# EAGLE board FlatSat_Final (EAGLE 9.6.2), part 1 of 2
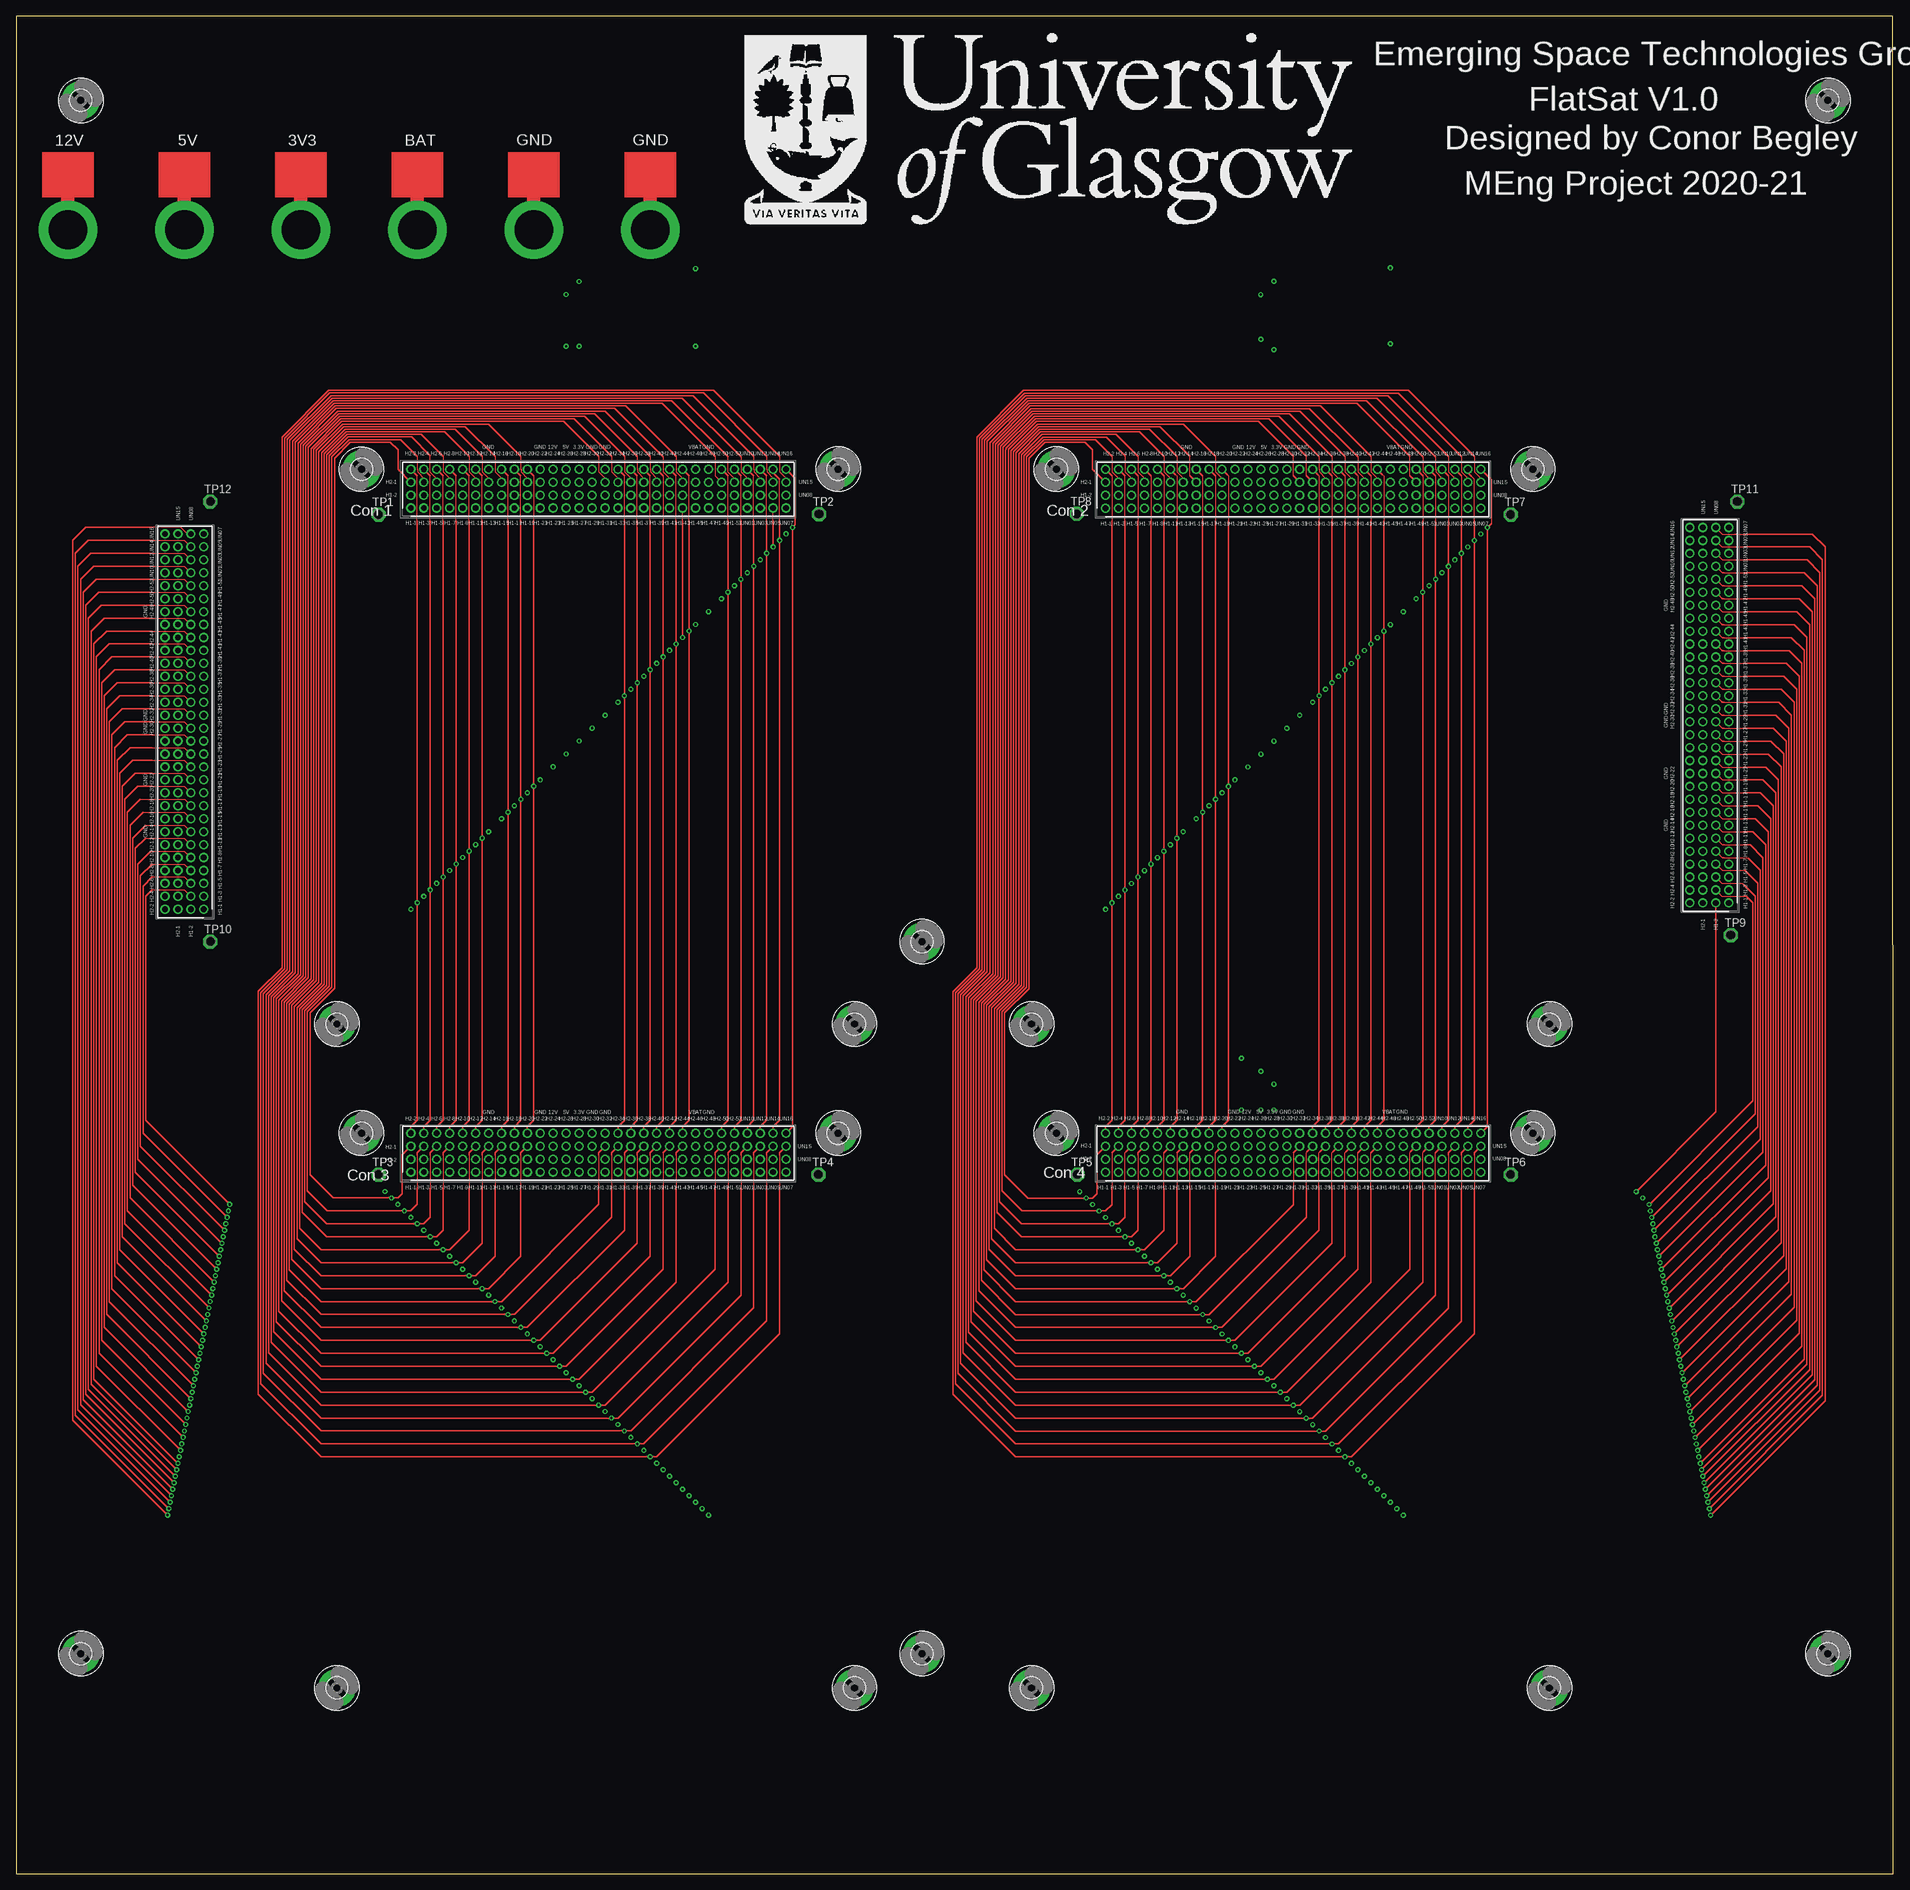
[diagram p6: board, top side]
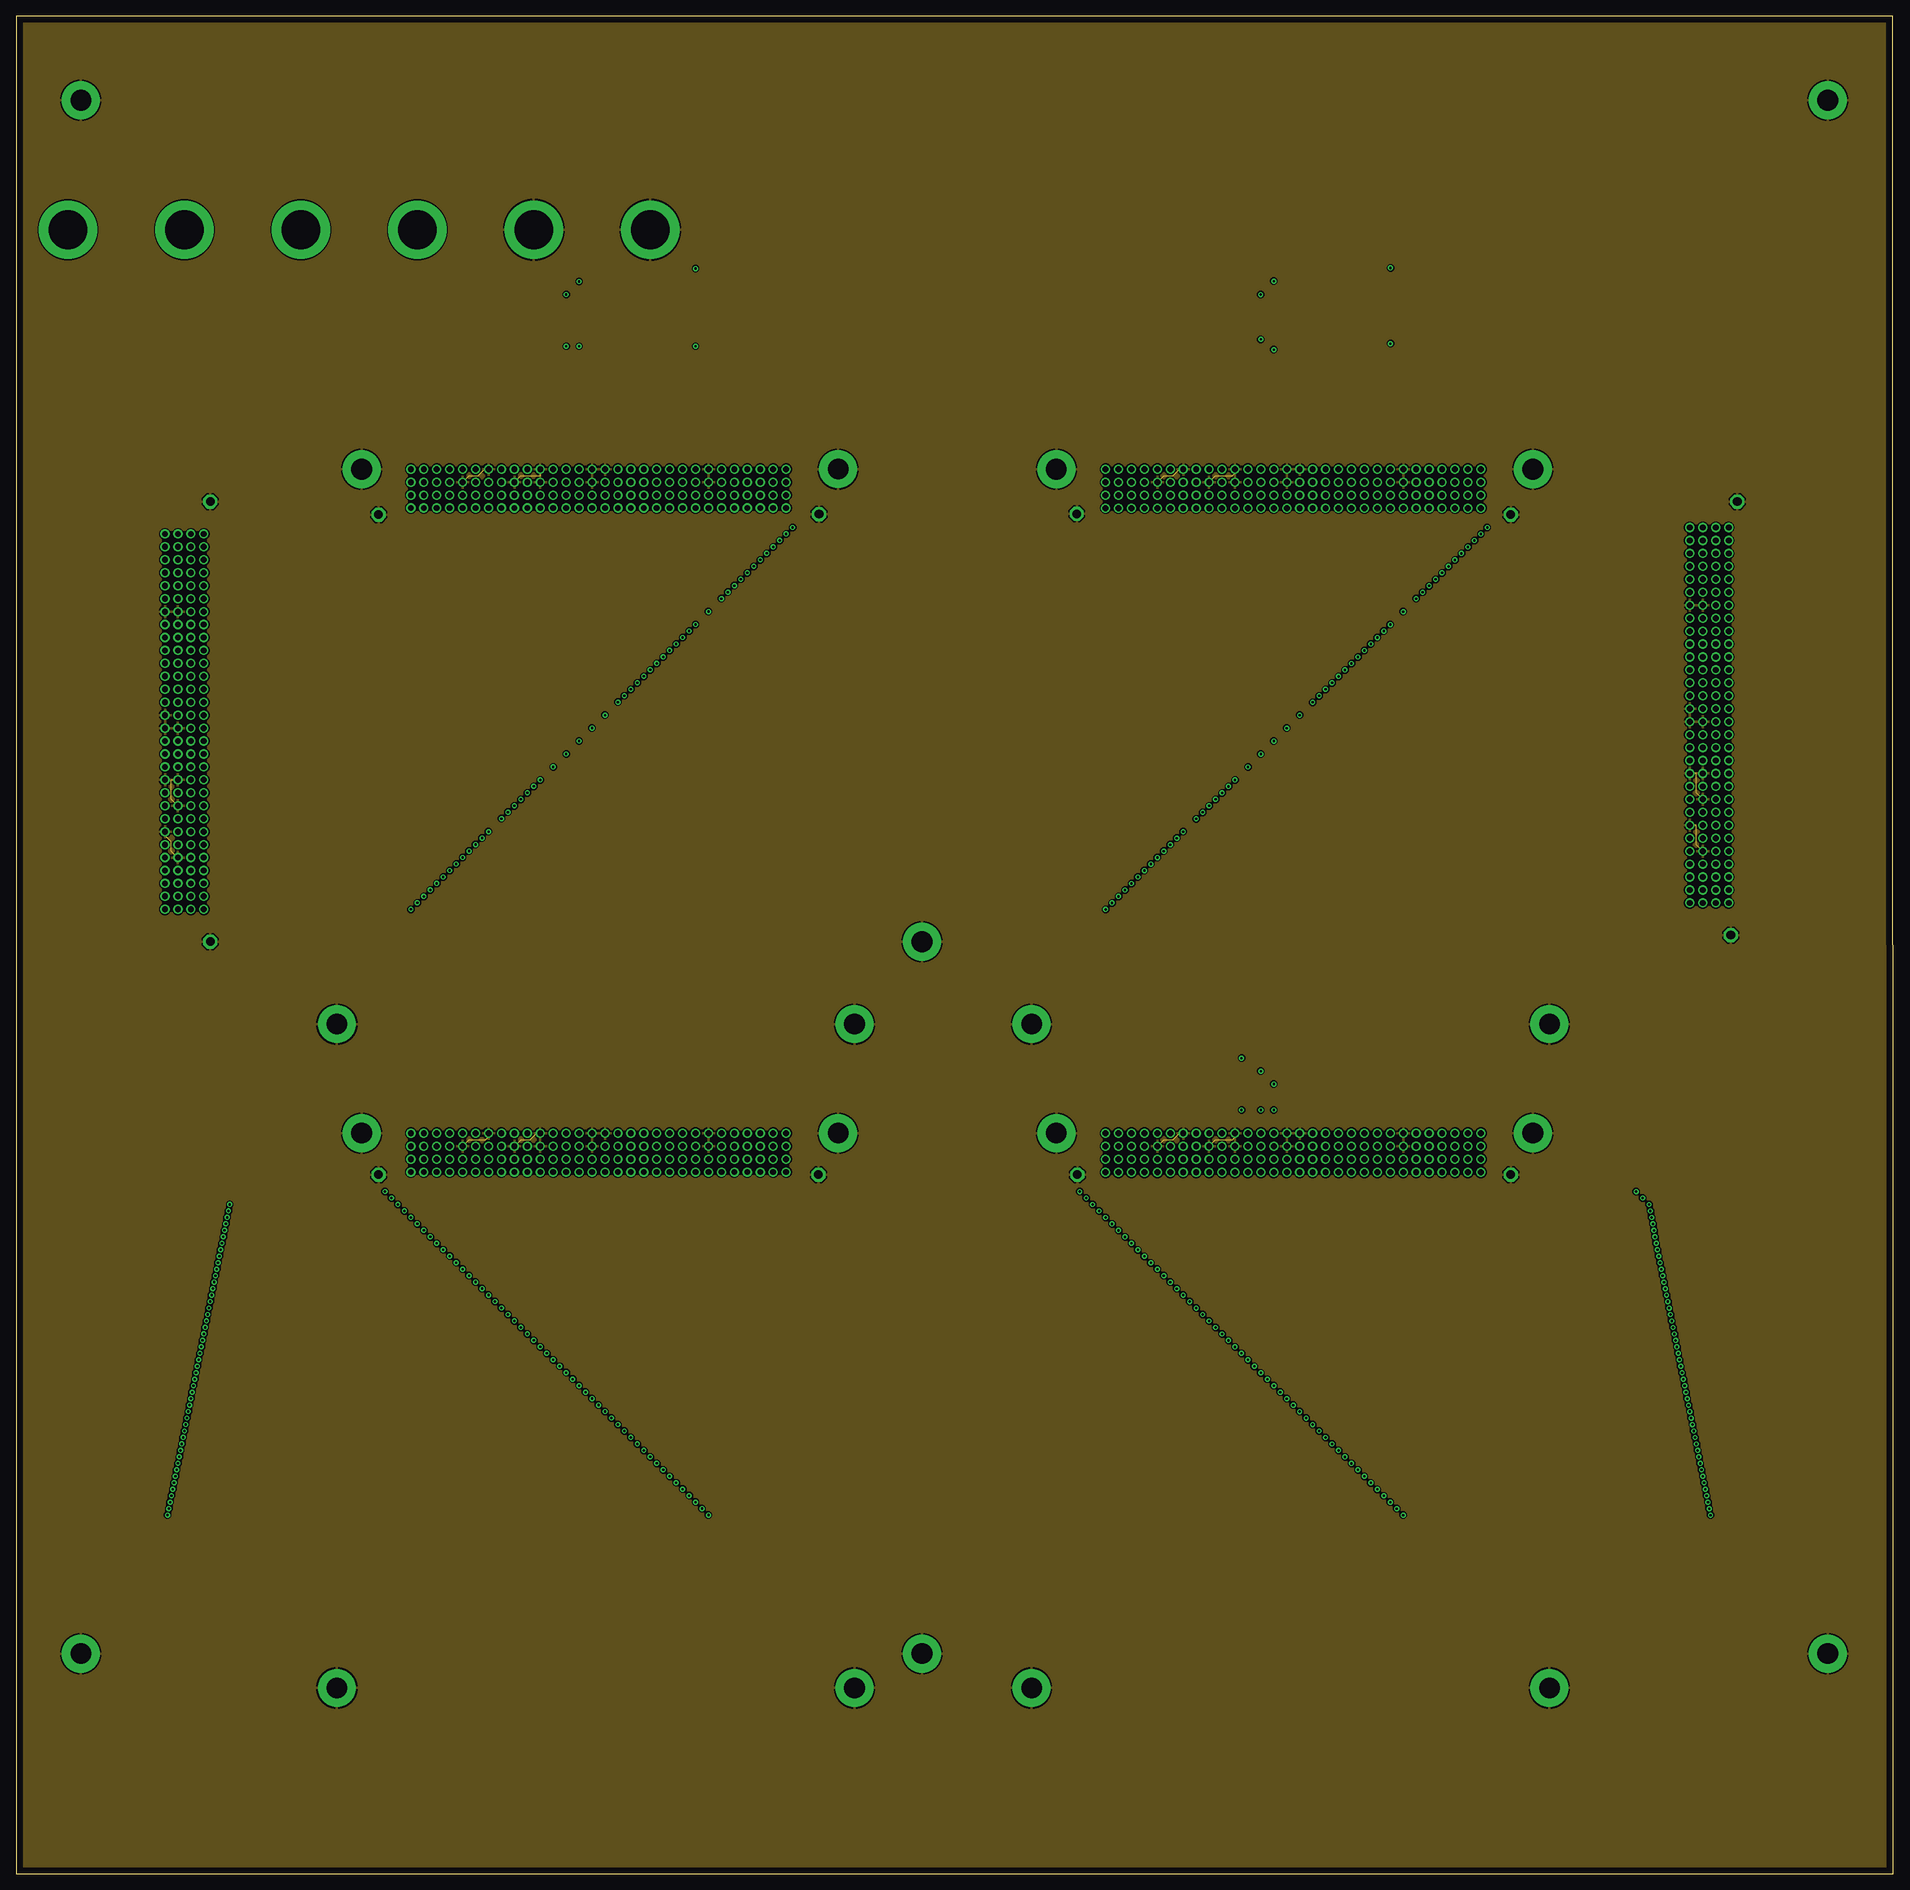
[diagram p7: board, inner layer Route2]
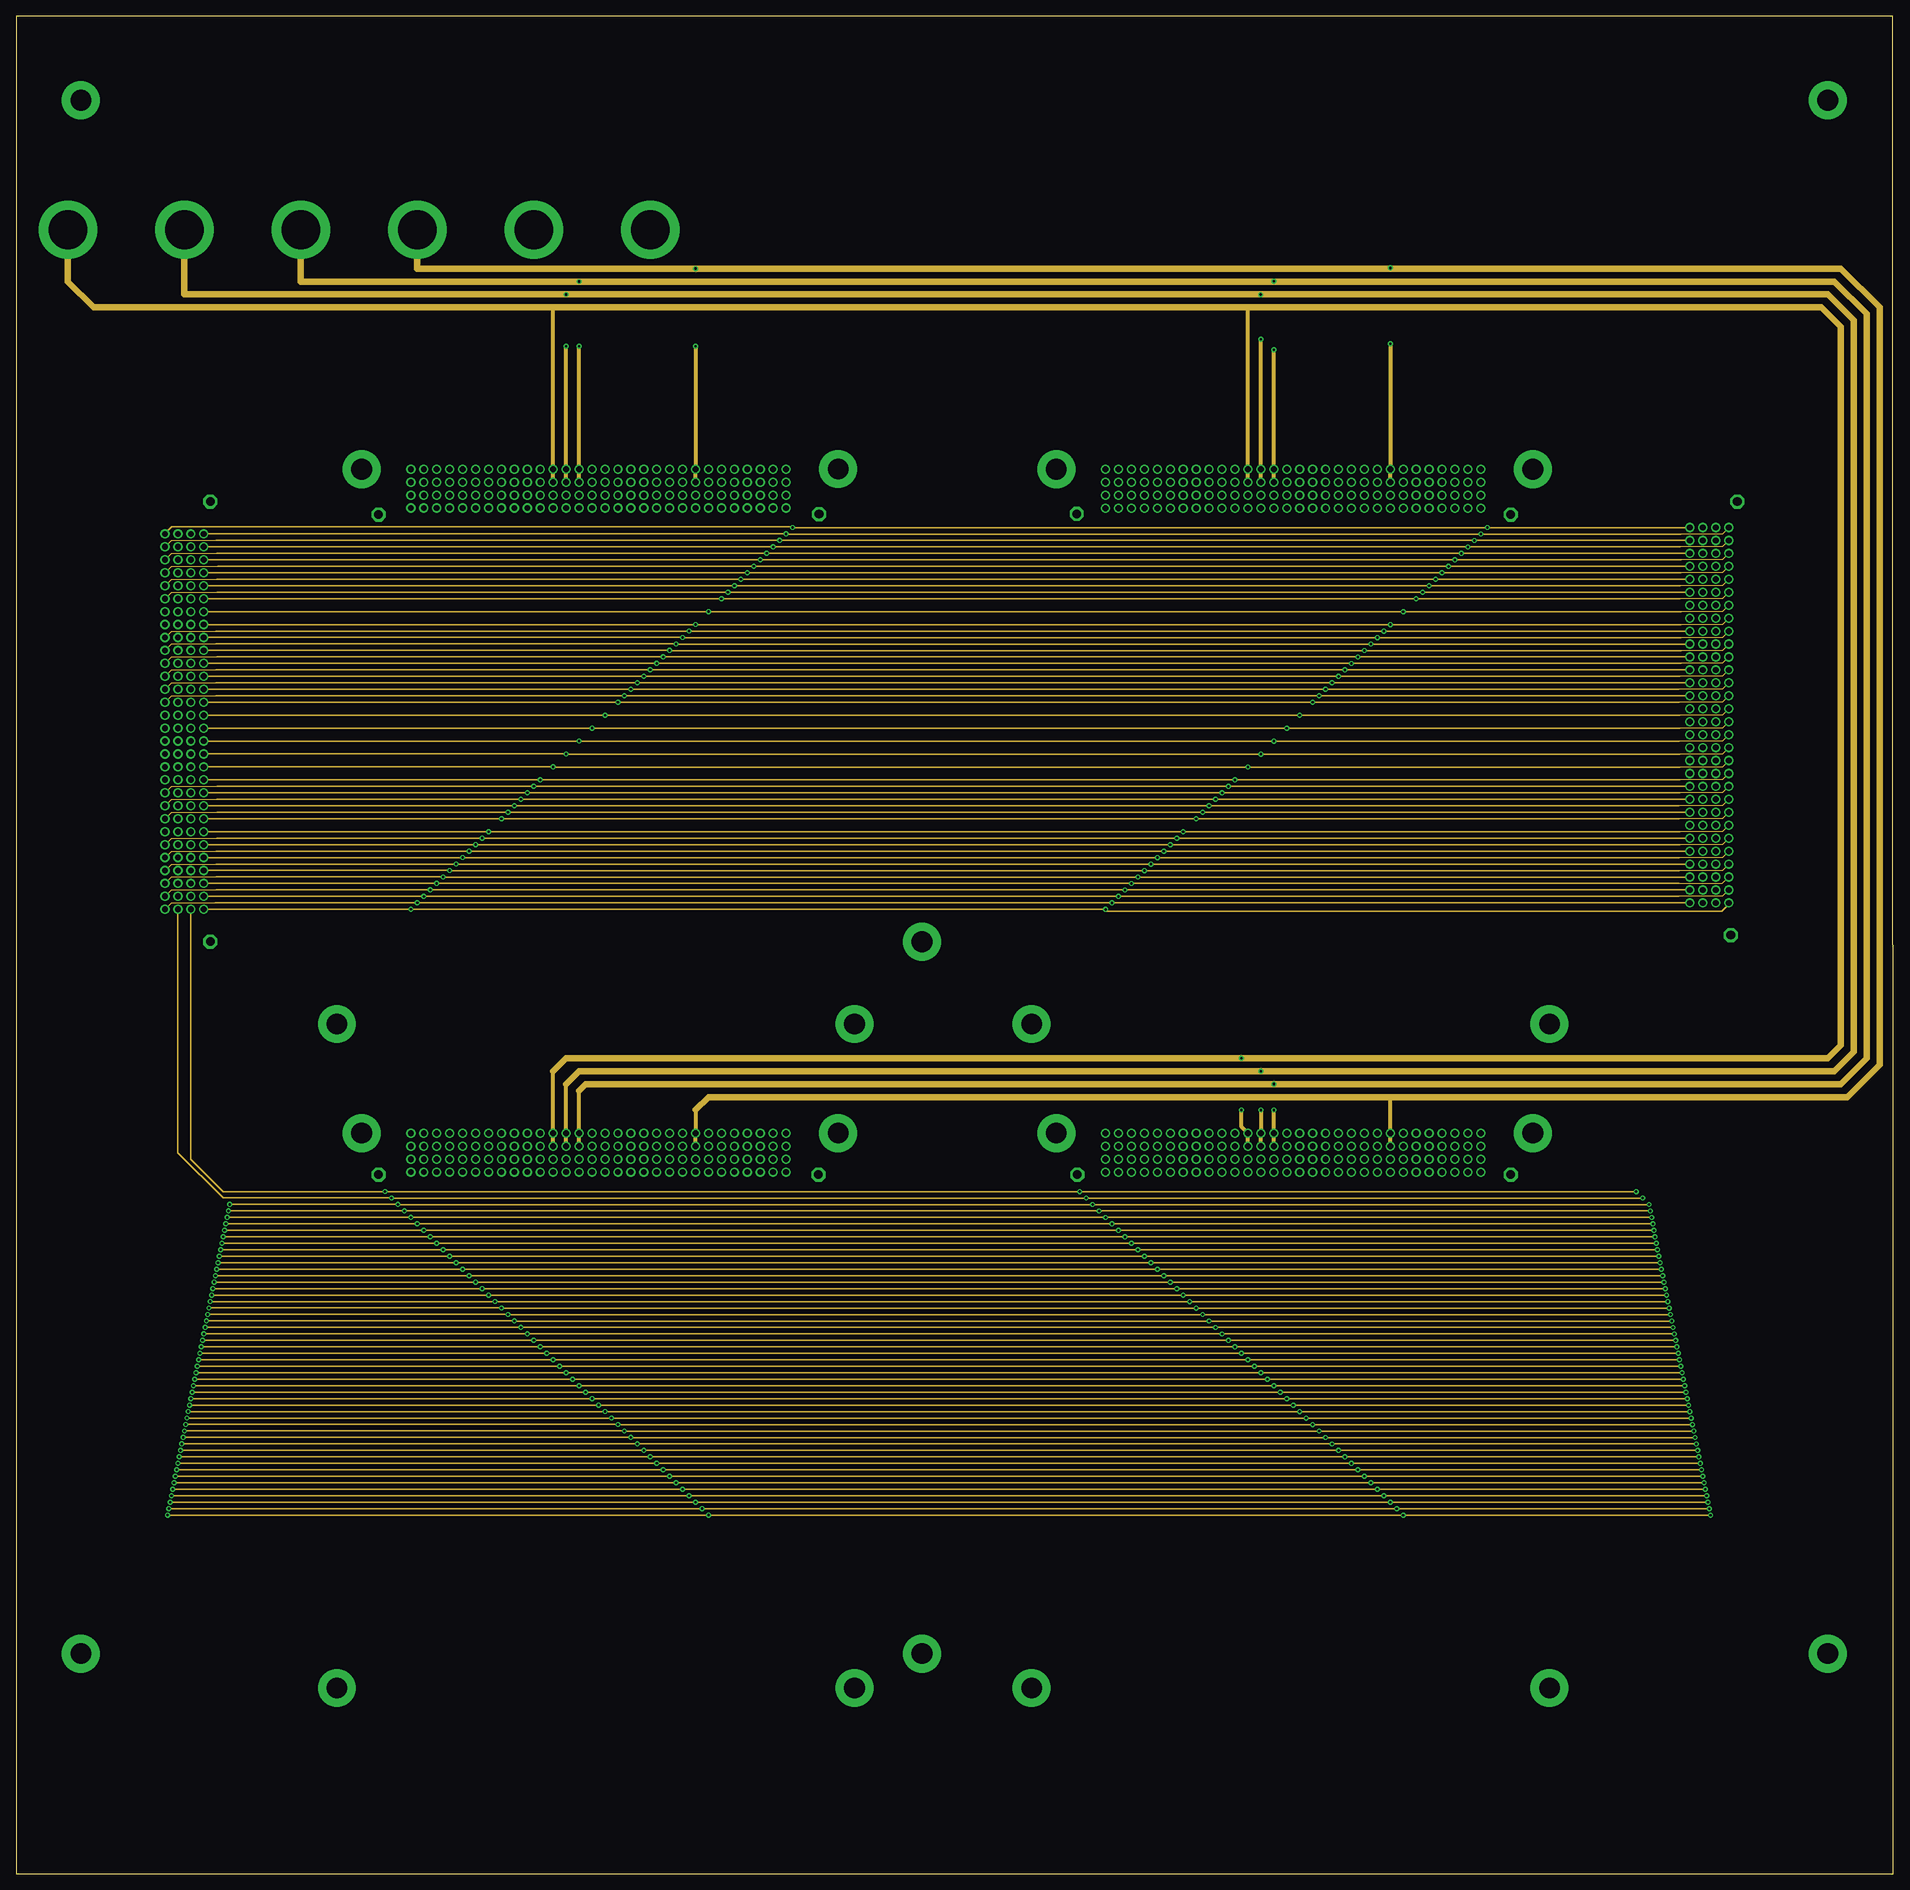
[diagram p8: board, inner layer Route15]
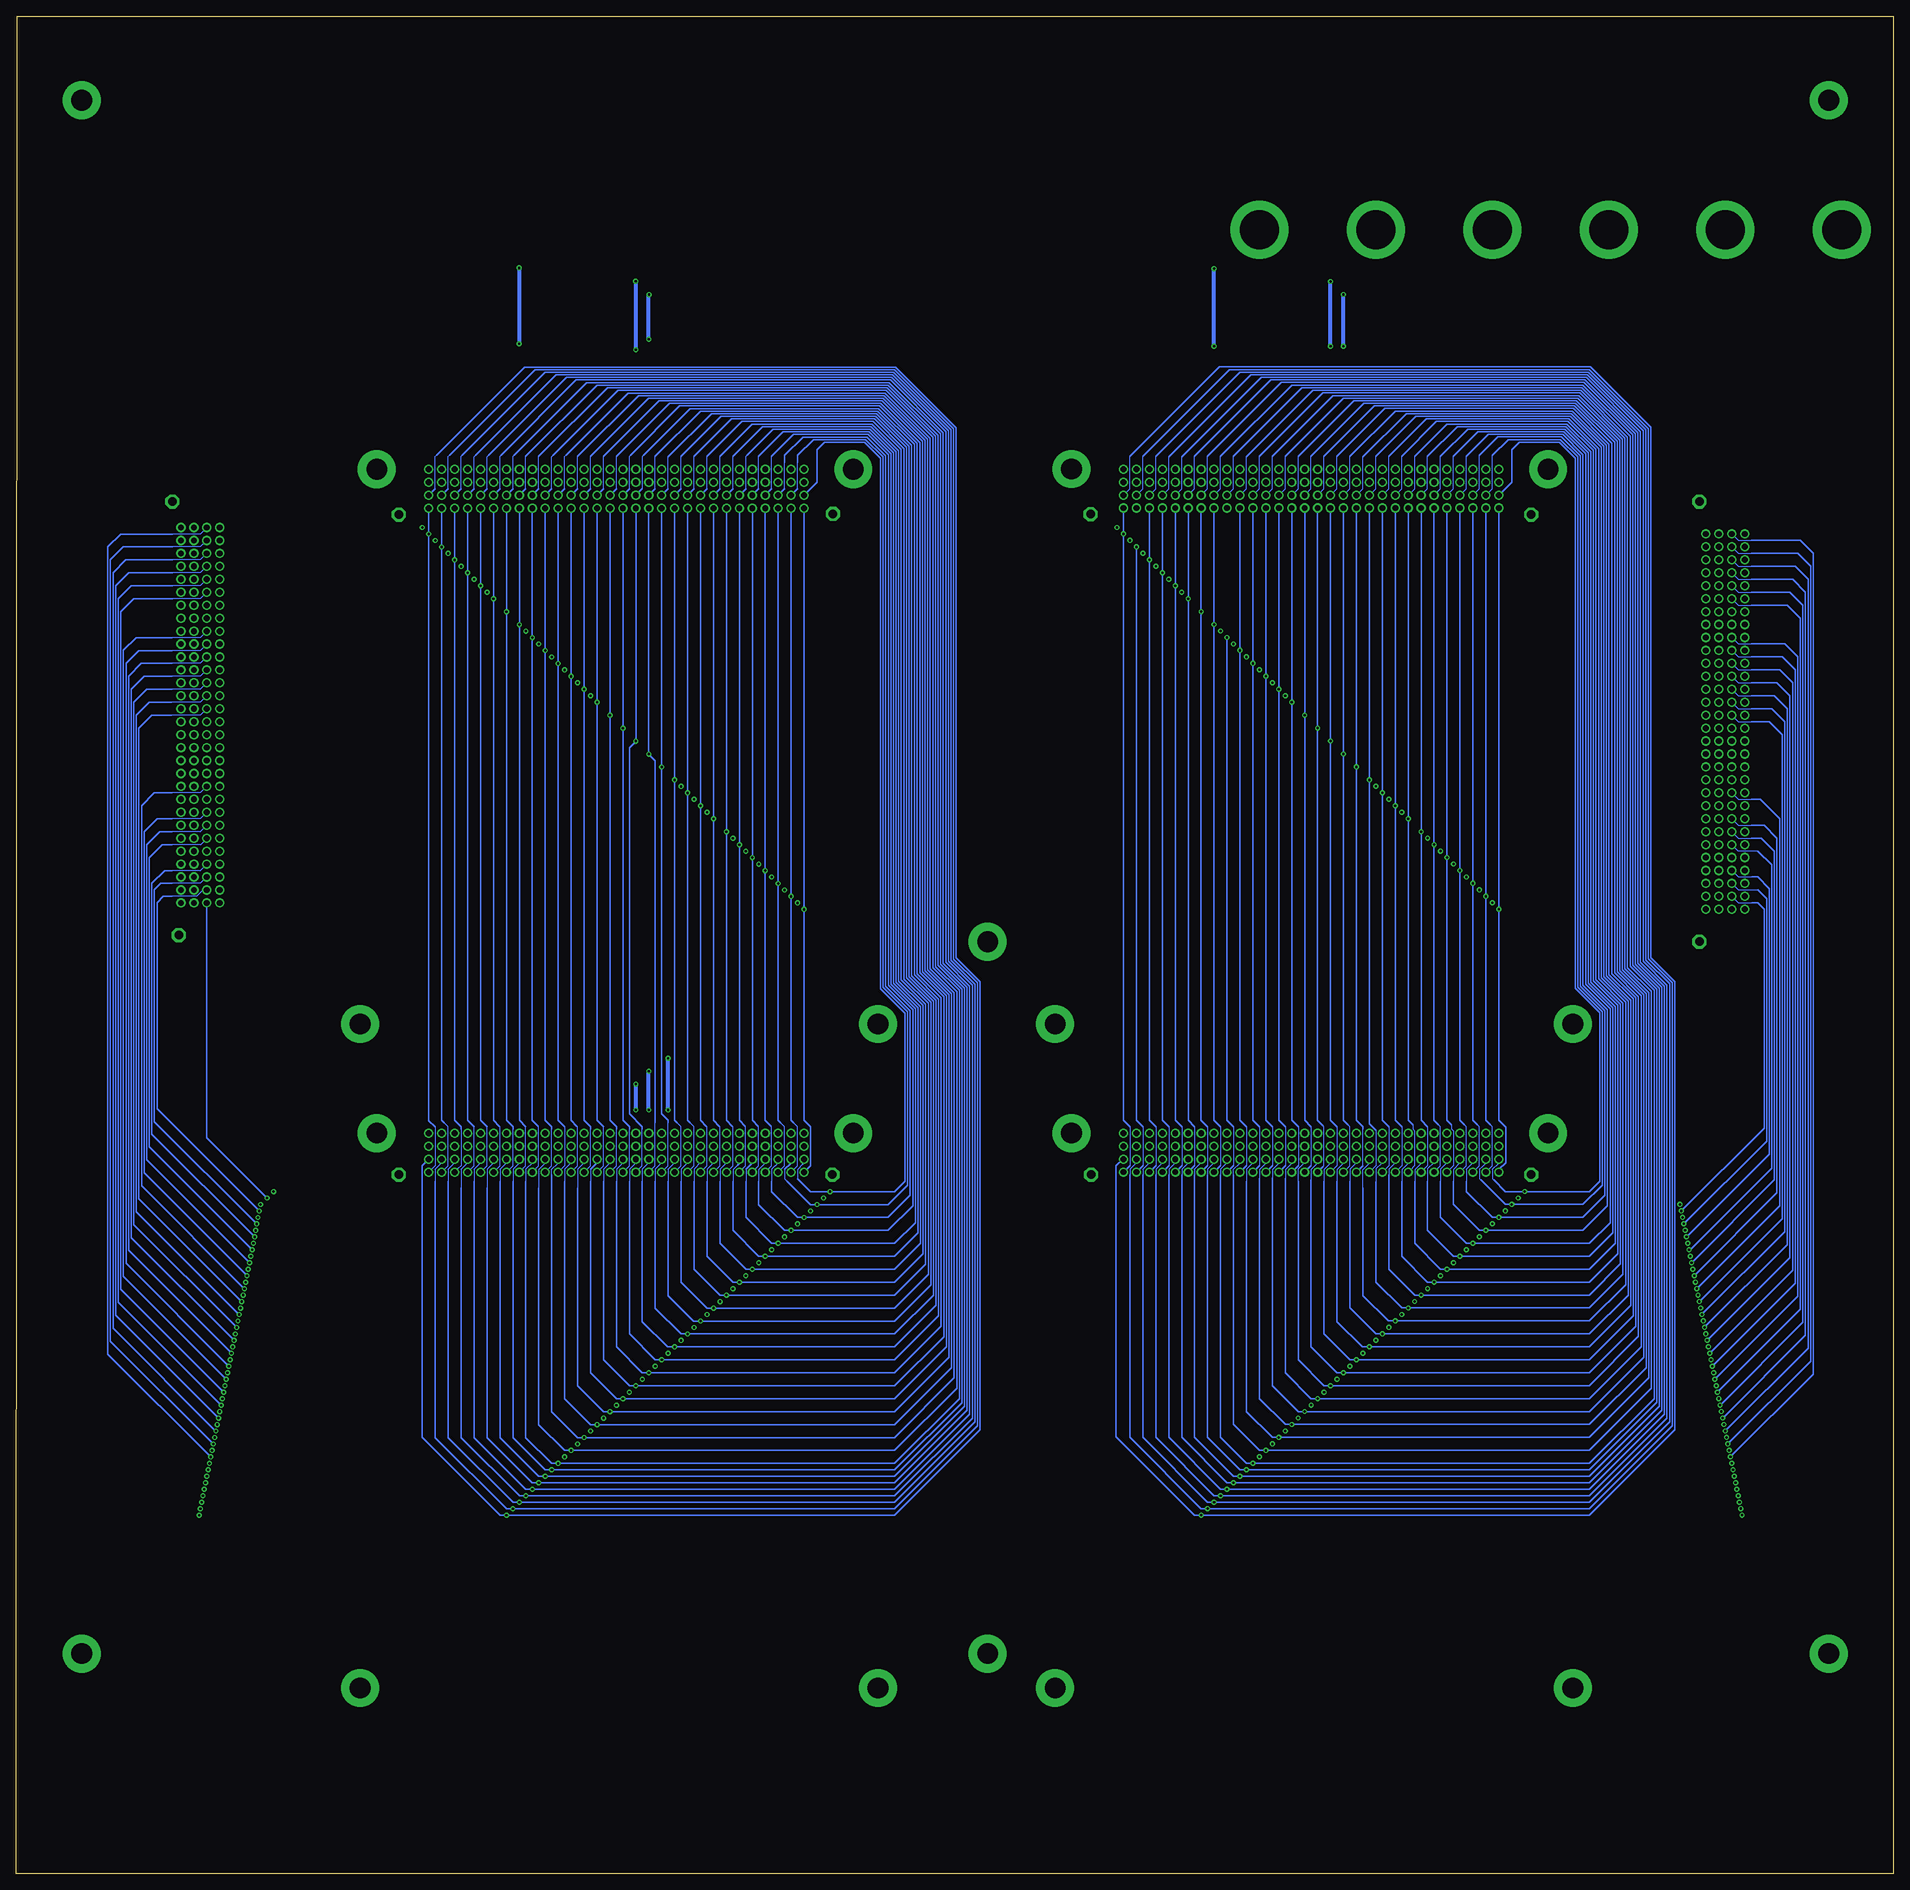
[diagram p9: board, bottom side, seen from below]

Size 290.14 x 287.01 mm. Coordinates in mm from the lower left corner, seen from the top.
Outline: 0,0.01 290.14,0 290,287.01 0,287.01 0,0.01
Copper layers (1*2*15*16): Top 0.035mm / dielectric 1.5mm / Route2 0.035mm / dielectric 0.15mm / Route15 0.035mm / dielectric 0.2mm / Bottom 0.035mm
Design rules "default *": minimum track width 6mil, minimum drill 0.35mm, track to track 0.2mm, track to pad 0.2mm, pad to pad 0.54mm, via to via 10mil, smd to smd 6mil, copper to edge 40mil, drill to drill 6mil, minimum pad ring 10mil, minimum via ring 8mil, stop-mask expansion 4mil, vias tented up to drill 0mil, thermal gap 10mil

## Footprints (pad centres in the part's own frame; a part is rotated, then mirrored left to right if it is on the bottom)
3,2-PAD = drill 3.2 pad 5.842: B3,2 0,0
RHDR120W55P200_4X30_6020X820X9 = drill 0.9 pad 1.3: P$1 0,6; P$2 2,6; P$3 4,6; P$4 6,6; P$5 8,6; P$6 10,6; P$7 12,6; P$8 14,6; P$9 16,6; P$10 18,6; P$11 20,6; P$12 22,6; P$13 24,6; P$14 26,6; P$15 28,6; P$16 30,6; P$17 32,6; P$18 34,6; P$19 36,6; P$20 38,6; P$21 40,6; P$22 42,6; P$23 44,6; P$24 46,6; P$25 48,6; P$26 50,6; P$27 52,6; P$28 54,6; P$29 56,6; P$30 58,6; P$31 0,4; P$32 2,4; P$33 4,4; P$34 6,4; P$35 8,4; P$36 10,4; P$37 12,4; P$38 14,4; P$39 16,4; P$40 18,4; P$41 20,4; P$42 22,4; P$43 24,4; P$44 26,4; P$45 28,4; P$46 30,4; P$47 32,4; P$48 34,4; P$49 36,4; P$50 38,4; P$51 40,4; P$52 42,4; P$53 44,4; P$54 46,4; P$55 48,4; P$56 50,4; P$57 52,4; P$58 54,4; P$59 56,4; P$60 58,4; P$61 0,2; P$62 2,2; P$63 4,2; P$64 6,2; P$65 8,2; P$66 10,2; P$67 12,2; P$68 14,2; P$69 16,2; P$70 18,2; P$71 20,2; P$72 22,2; P$73 24,2; P$74 26,2; P$75 28,2; P$76 30,2; P$77 32,2; P$78 34,2; P$79 36,2; P$80 38,2; P$81 40,2; P$82 42,2; P$83 44,2; P$84 46,2; P$85 48,2; P$86 50,2; P$87 52,2; P$88 54,2; P$89 56,2; P$90 58,2; P$91 0,0; P$92 2,0; P$93 4,0; P$94 6,0; P$95 8,0; P$96 10,0; P$97 12,0; P$98 14,0; P$99 16,0; P$100 18,0; P$101 20,0; P$102 22,0; P$103 24,0; P$104 26,0; P$105 28,0; P$106 30,0; P$107 32,0; P$108 34,0; P$109 36,0; P$110 38,0; P$111 40,0; P$112 42,0; P$113 44,0; P$114 46,0; P$115 48,0; P$116 50,0; P$117 52,0; P$118 54,0; P$119 56,0; P$120 58,0
P1-13 = drill 1.321 pad 2.159 octagon: TP 0,0
BANANA-PRINT = drill 6 pad 9: P$1 0,0

## Placement (x,y rotation side)
H1  MOUNT-PAD-ROUND3.2  [3,2-PAD]  53.38,217.01 0 top
H2  MOUNT-PAD-ROUND3.2  [3,2-PAD]  127.04,217.03 0 top
H3  MOUNT-PAD-ROUND3.2  [3,2-PAD]  49.57,131.28 0 top
H4  MOUNT-PAD-ROUND3.2  [3,2-PAD]  129.57,131.28 0 top
H5  MOUNT-PAD-ROUND3.2  [3,2-PAD]  160.76,217.02 0 top
H6  MOUNT-PAD-ROUND3.2  [3,2-PAD]  234.41,217.02 0 top
H7  MOUNT-PAD-ROUND3.2  [3,2-PAD]  160.76,114.43 0 top
H8  MOUNT-PAD-ROUND3.2  [3,2-PAD]  156.94,131.28 0 top
H9  MOUNT-PAD-ROUND3.2  [3,2-PAD]  236.97,131.28 0 top
H10  MOUNT-PAD-ROUND3.2  [3,2-PAD]  156.94,28.7 0 top
H11  MOUNT-PAD-ROUND3.2  [3,2-PAD]  236.97,28.7 0 top
H12  MOUNT-PAD-ROUND3.2  [3,2-PAD]  234.41,114.43 0 top
H13  MOUNT-PAD-ROUND3.2  [3,2-PAD]  53.38,114.43 0 top
H14  MOUNT-PAD-ROUND3.2  [3,2-PAD]  127.04,114.43 0 top
H15  MOUNT-PAD-ROUND3.2  [3,2-PAD]  49.57,28.7 0 top
H16  MOUNT-PAD-ROUND3.2  [3,2-PAD]  129.57,28.7 0 top
H17  MOUNT-PAD-ROUND3.2  [3,2-PAD]  10,274.01 0 top
H18  MOUNT-PAD-ROUND3.2  [3,2-PAD]  280,34.01 0 top
H19  MOUNT-PAD-ROUND3.2  [3,2-PAD]  10,34.01 0 top
H20  MOUNT-PAD-ROUND3.2  [3,2-PAD]  280,274.01 0 top
H21  MOUNT-PAD-ROUND3.2  [3,2-PAD]  140,34.01 0 top
H22  MOUNT-PAD-ROUND3.2  [3,2-PAD]  140,144.01 0 top
J1  M22-6013005  [RHDR120W55P200_4X30_6020X820X9]  61,108.41 0 top
J2  M22-6013005  [RHDR120W55P200_4X30_6020X820X9]  61,211.01 0 top
J3  M22-6013005  [RHDR120W55P200_4X30_6020X820X9]  168.37,108.4 0 top
J4  M22-6013005  [RHDR120W55P200_4X30_6020X820X9]  168.37,211 0 top
J5  M22-6013005  [RHDR120W55P200_4X30_6020X820X9]  29,149.01 90 top
J6  M22-6013005  [RHDR120W55P200_4X30_6020X820X9]  264.67,150 90 top
TP1  PTR1PAD1-13  [P1-13]  56,210.01 0 top
TP2  PTR1PAD1-13  [P1-13]  124.08,210.07 0 top
TP3  PTR1PAD1-13  [P1-13]  56,108.01 0 top
TP4  PTR1PAD1-13  [P1-13]  124,108.01 0 top
TP5  PTR1PAD1-13  [P1-13]  164,108.01 0 top
TP6  PTR1PAD1-13  [P1-13]  231,108.01 0 top
TP7  PTR1PAD1-13  [P1-13]  231,210.01 0 top
TP8  PTR1PAD1-13  [P1-13]  163.91,210.11 0 top
TP9  PTR1PAD1-13  [P1-13]  265,145.01 0 top
TP10  PTR1PAD1-13  [P1-13]  30,144.01 0 top
TP11  PTR1PAD1-13  [P1-13]  266,212.01 0 top
TP12  PTR1PAD1-13  [P1-13]  30,212.01 0 top
U$1  BANANA-JACK  [BANANA-PRINT]  8,254.01 0 top
U$2  BANANA-JACK  [BANANA-PRINT]  26,254.01 0 top
U$3  BANANA-JACK  [BANANA-PRINT]  44,254.01 0 top
U$4  BANANA-JACK  [BANANA-PRINT]  98,254.01 0 top
U$5  BANANA-JACK  [BANANA-PRINT]  80,254.01 0 top
U$6  BANANA-JACK  [BANANA-PRINT]  62,254.01 0 top

## Tracks (layer width: path | path; a pad name or v marks a point on that pad's centre or on a via)
+3.3V  (via drill 0.35)
  Route15 0.6: v87,236.01 J2.P$14 J2.P$44 | 194.43,246.01 v194.38,246.06 194.33,246.01 | 87,121.01 J1.P$14 J1.P$44 | J3.P$44 J3.P$14 v194.37,118 | J4.P$44 J4.P$14 v194.37,235.48
  Route15 1: U$3.P$1 44,246.01 v87,246.01 194.33,246.01 | 194.43,246.01 281,246.01 286,241.01 286,126 282,122 v194.37,122 87.99,122 87,121.01
  Bottom 0.6: v87,236.01 v87,246.01 | v194.37,118 v194.37,122 | v194.37,235.48 v194.37,246.05 v194.38,246.06
+5V  (via drill 0.35)
  Route15 0.6: v85,236.01 J2.P$13 J2.P$43 | 85,122.01 J1.P$13 J1.P$43 | v192.37,118 J3.P$13 J3.P$43 | J4.P$43 J4.P$13 v192.37,237.08 | 192.36,244.01 v192.34,243.99 192.32,244.01
  Route15 1: U$2.P$1 26,244.01 v85,244.01 192.32,244.01 | 192.36,244.01 280,244.01 284,240.01 284,127 281,124 v192.37,124 86.99,124 85,122.01
  Bottom 0.6: v85,236.01 v85,244.01 | v192.37,118 v192.37,124 | v192.37,237.08 192.37,243.96 v192.34,243.99
+12V  (via drill 0.35)
  Route15 0.6: 83,242.01 J2.P$12 J2.P$42 | 83,124.01 J1.P$12 J1.P$42 | 190.37,242.01 J4.P$12 J4.P$42 | J3.P$42 J3.P$12 189.37,115.4 v189.37,118
  Route15 1: U$1.P$1 8,246.01 12,242.01 83,242.01 190.37,242.01 279,242.01 282,239.01 282,128 280,126 v189.37,126 84.99,126 83,124.01
  Bottom 0.6: v189.37,118 v189.37,126
GND
  Route2 0.17: J3.P$35 177.38,113.41 178.78,113.41 179.77,114.4 J3.P$7 | J4.P$39 185.38,216.01 188,216.01 188.37,216.38 J4.P$11 | J5.P$35 23.99,158.02 23.99,159.42 23,160.41 J5.P$7 | J1.P$39 78.01,113.42 79.41,113.42 80.4,114.41 J1.P$11 | J2.P$35 70.01,216.02 71.41,216.02 72.4,217.01 J2.P$7 | J4.P$35 177.38,216.01 178.78,216.01 179.77,217 J4.P$7 | J3.P$39 185.36,113.39 188,113.39 188.37,113.76 188.37,114.01 J3.P$11 | J5.P$39 23.99,166.02 23.99,168.96 24.04,169.01 J5.P$41 | J2.P$39 77.99,216 81.02,216 81.02,216.99 J2.P$11 | J1.P$35 70,113.41 72.53,113.41 73,113.88 J1.P$7 | J6.P$39 259.67,167 259.67,170.07 258.74,170.07 J6.P$11 | J6.P$35 259.66,159.01 259.66,161.9 259.56,162 J6.P$7
  pour Route2 (isolate 0.2): -0.09,286.94 290,286.94 290,0.04 -0.09,0.04
H1-1  (via drill 0.35)
  Route15 0.2: J5.P$91 v61,149.01 v61.01,149 v168.37,149 168.64,148.73 263.63,148.73 264.67,149.77 J6.P$91
  Bottom 0.2: J1.P$91 61,108.81 59.92,109.89 59.92,115.33 61,116.41 v61,149.01 J2.P$91 | J3.P$91 167.35,109.42 167.35,115.38 168.37,116.4 v168.37,149 J4.P$91
H1-2  (via drill 0.35)
  Top 0.2: v250.37,105.4 262.67,117.7 J6.P$61
  Route15 0.2: J5.P$61 27,110.41 32,105.41 v57,105.41 v57.01,105.4 v164.37,105.4 v250.37,105.4
  Bottom 0.17: 168.57,109.6 169.37,108.8 169.37,107.4 | J1.P$61 61,109.81 61.99,108.82 61.99,107.4 61.8,107.21
  Bottom 0.2: 61.8,107.21 60,105.41 v57,105.41 47,105.41 45.4,107.01 45.4,133 49.18,136.78 49.18,218.74 51.64,221.2 57.81,221.2 59,220.01 59,215.01 J2.P$61 | 169.37,107.4 167.37,105.4 v164.37,105.4 154.37,105.4 152.77,107 152.77,132.99 156.55,136.77 156.55,218.73 159.01,221.19 165.18,221.19 166.37,220 166.37,215 J4.P$61 | J3.P$61 168.37,109.8 168.57,109.6
H1-3  (via drill 0.35)
  Route15 0.17: J6.P$92 263.67,151 256.97,151
  Route15 0.2: J5.P$92 v63,151.01 v63.01,151 v170.37,151 256.97,151
  Bottom 0.17: 169.99,116.02 169.38,115.41 169.38,109.39 J3.P$92 | 62.3,115.71 62.01,115.42 62.01,109.4 J1.P$92
  Bottom 0.2: 62.3,115.71 63,116.41 v63,151.01 J2.P$92 | 169.99,116.02 170.37,116.4 v170.37,151 J4.P$92
H1-4  (via drill 0.35)
  Top 0.17: 267.01,151 263.63,151 262.67,151.96 J6.P$62 | 21,152.01 26,152.01 J5.P$62
  Top 0.2: v33,103.41 20,116.41 20,151.01 21,152.01 | v252.37,103.4 268.37,119.4 268.37,150.01 267.38,151 267.01,151
  Route15 0.2: v33,103.41 v59,103.41 v59.01,103.4 v166.37,103.4 v252.37,103.4
  Bottom 0.17: 169.37,214 169.37,218.01 | 170.99,107.02 171.36,107.39 171.36,108.85 | J1.P$62 63,109.81 63.64,109.17 63.99,108.82 63.99,107.4 63.8,107.21 | J2.P$62 62,214.01 62,219.15
  Bottom 0.2: 62,219.15 59.56,221.6 51.47,221.6 48.78,218.91 48.78,136.95 45,133.17 45,106.41 48,103.41 v59,103.41 60,103.41 63.8,107.21 | J4.P$62 169.37,214 | 169.37,218.01 169.37,219.14 166.93,221.59 158.84,221.59 156.15,218.9 156.15,136.94 152.37,133.16 152.37,106.4 155.37,103.4 v166.37,103.4 167.37,103.4 170.99,107.02 | J3.P$62 170.5,110.27 170.5,109.71 171.36,108.85
H1-5  (via drill 0.35)
  Route15 0.17: 257,153 257.01,153.01 263.68,153.01 264.65,153.99
  Route15 0.2: J5.P$93 v65,153.01 v65.01,153 v172.37,153 257,153 | 264.65,153.99 J6.P$93
  Bottom 0.17: 171.99,116.02 171.38,115.41 171.38,109.39 J3.P$93 | 64.3,115.71 64.01,115.42 64.01,109.4 J1.P$93
  Bottom 0.2: 64.3,115.71 65,116.41 v65,153.01 J2.P$93 | 171.99,116.02 172.37,116.4 v172.37,153 J4.P$93
H1-6  (via drill 0.35)
  Top 0.17: J6.P$63 262.67,153.98 263.64,153.01 266.77,153.01 266.92,152.86 | 21,154.01 26,154.01 J5.P$63
  Top 0.2: v32.6,101.41 19.6,114.41 19.6,152.61 21,154.01 | v252.77,101.4 268.77,117.4 268.77,151.01 266.92,152.86
  Route15 0.2: v32.6,101.41 v61,101.41 v61.01,101.4 v168.37,101.4 v252.77,101.4
  Bottom 0.17: 171.37,214 171.37,218.01 | 172.37,109.86 172.88,109.35 172.88,109.36 173.37,108.87 173.37,107.01 | J1.P$63 65,109.84 66,108.84 66,107.01 | J2.P$63 64,214.01 64,219.15
  Bottom 0.2: 64,219.15 61.16,222 51.31,222 48.38,219.07 48.38,137.12 44.6,133.33 44.6,104.81 48,101.41 v61,101.41 62,101.41 66,105.41 66,107.01 | J4.P$63 171.37,214 | 171.37,218.01 171.37,219.14 168.53,221.99 158.68,221.99 155.75,219.06 155.75,137.11 151.97,133.32 151.97,104.8 155.37,101.4 v168.37,101.4 169.37,101.4 173.37,105.4 173.37,107.01 | J3.P$63 172.37,109.86
H1-7  (via drill 0.35)
  Route15 0.17: J6.P$94 263.67,155 257.07,155
  Route15 0.2: J5.P$94 v67,155.01 v67.01,155 v174.37,155 257.07,155
  Bottom 0.17: 173.49,115.52 173.38,115.41 173.38,109.39 J3.P$94 | 66.3,115.71 66.01,115.42 66.01,109.4 J1.P$94
  Bottom 0.2: 66.3,115.71 67,116.41 v67,155.01 J2.P$94 | 173.49,115.52 174.37,116.4 v174.37,155 J4.P$94
H1-8  (via drill 0.35)
  Top 0.17: J6.P$64 263.66,155.01 265.08,155.01 267.17,155.01 | 21,156.01 26,156.01 J5.P$64
  Top 0.2: v32.2,99.41 19.2,112.41 19.2,154.21 21,156.01 | v253.13,99.4 269.17,115.44 269.17,153.01 267.17,155.01
  Route15 0.2: v32.2,99.41 v63,99.41 v63.01,99.4 v170.37,99.4 v253.13,99.4
  Bottom 0.17: 173.37,214 173.37,219 | 174.37,109.8 175.37,108.8 175.37,107.01 | 67,109.82 67.9,108.92 67.9,108.91 68,108.81 68,107.01 | J2.P$64 66,214.01 66,219.01
  Bottom 0.2: 66,219.01 62.61,222.4 51.14,222.4 47.98,219.24 47.98,137.28 44.2,133.5 44.2,103.21 48,99.41 v63,99.41 64,99.41 68,103.41 68,107.01 | J1.P$64 67,109.82 | J4.P$64 173.37,214 | 173.37,219 169.98,222.39 158.51,222.39 155.35,219.23 155.35,137.27 151.57,133.49 151.57,103.2 155.37,99.4 v170.37,99.4 171.37,99.4 175.37,103.4 175.37,107.01 | J3.P$64 174.37,109.8
H1-9  (via drill 0.35)
  Route15 0.17: J6.P$95 263.67,157 257.07,157
  Route15 0.2: J5.P$95 v69,157.01 v69.01,157 v176.37,157 257.07,157
  Bottom 0.17: 175.49,115.52 175.38,115.41 175.38,109.39 J3.P$95 | 68.3,115.71 68.3,115.11 68.01,114.82 68.01,109.4 68.7,108.71
  Bottom 0.2: 68.7,108.71 J1.P$95 | 68.3,115.71 69,116.41 v69,157.01 J2.P$95 | 175.49,115.52 176.37,116.4 v176.37,157 J4.P$95
H1-10  (via drill 0.35)
  Top 0.17: J6.P$65 263.67,157 | 264,157 267.58,157 267.68,156.9 | 20.8,158.01 26,158.01 J5.P$65
  Top 0.2: v31.8,97.41 18.8,110.41 18.8,156.01 20.8,158.01 | v253.47,97.4 269.57,113.5 269.57,155.01 267.68,156.9 | 263.67,157 264,157
  Route15 0.2: v31.8,97.41 v65,97.41 v65.01,97.4 v172.37,97.4 v253.47,97.4
  Bottom 0.17: 175.37,214 175.37,219 | 177.37,108.83 177.37,107.01 | J1.P$65 69,109.87 69.61,109.26 69.61,109.25 70,108.87 70,107.01 | J2.P$65 68,214.01 68,219.01
  Bottom 0.2: 68,219.01 64.21,222.8 50.97,222.8 47.58,219.41 47.58,137.45 43.8,133.66 43.8,100.61 47,97.41 v65,97.41 66,97.41 70,101.41 70,107.01 | J4.P$65 175.37,214 | 175.37,219 171.58,222.79 158.34,222.79 154.95,219.4 154.95,137.44 151.17,133.65 151.17,100.6 154.37,97.4 v172.37,97.4 173.37,97.4 177.37,101.4 177.37,107.01 | J3.P$65 176.37,109.83 177.37,108.83
H1-11  (via drill 0.35)
  Route15 0.17: J6.P$96 263.67,159 257.14,159
  Route15 0.2: J5.P$96 v71,159.01 v71.01,159 v178.37,159 257.14,159
  Bottom 0.17: 177.49,115.52 177.38,115.41 177.38,109.39 J3.P$96 | 70.3,115.71 70.01,115.42 70.01,109.4 J1.P$96
  Bottom 0.2: 70.3,115.71 71,116.41 v71,159.01 J2.P$96 | 177.49,115.52 178.37,116.4 v178.37,159 J4.P$96
H1-12  (via drill 0.35)
  Top 0.17: J6.P$66 263.67,159 263.8,159 | 264,159 266.95,159 | J5.P$66 26,160.01 20,160.01
  Top 0.2: v31.4,95.41 18.4,108.41 18.4,158.41 20,160.01 | v253.87,95.4 269.97,111.5 269.97,157.01 267.98,159 266.95,159 | 263.8,159 264,159
  Route15 0.2: v31.4,95.41 v67,95.41 v67.01,95.4 v174.37,95.4 v253.87,95.4
  Bottom 0.17: 177.37,214.01 177.36,214.02 177.36,219.01 177.18,219.19 | 178.66,109.49 178.68,109.49 179.37,108.8 179.37,107.01 | J1.P$66 71,109.89 72,108.89 72,107.01 | J2.P$66 70,214.01 70,219.01
  Bottom 0.2: 70,219.01 65.81,223.2 50.81,223.2 47.18,219.57 47.18,137.61 43.4,133.83 43.4,99.01 47,95.41 v67,95.41 68,95.41 72,99.41 72,107.01 | J4.P$66 177.37,214 177.37,214.01 | 177.18,219.19 173.18,223.19 158.18,223.19 154.55,219.56 154.55,137.6 150.77,133.82 150.77,99 154.37,95.4 v174.37,95.4 175.37,95.4 179.37,99.4 179.37,107.01 | J3.P$66 178.37,109.78 178.66,109.49
H1-13  (via drill 0.35)
  Route15 0.17: J6.P$97 263.67,161 257.12,161
  Route15 0.2: J5.P$97 v73,161.01 v73.01,161 v180.37,161 257.12,161
  Bottom 0.17: 179.49,115.52 179.38,115.41 179.38,109.39 J3.P$97 | 72.01,115.42 72.01,109.4 72.7,108.71
  Bottom 0.2: 72.7,108.71 J1.P$97 | 72.01,115.42 73,116.41 v73,161.01 J2.P$97 | 179.49,115.52 180.37,116.4 v180.37,161 J4.P$97
H1-14  (via drill 0.35)
  Top 0.17: J6.P$67 263.67,161 266.96,161 | 20,162.01 26,162.01 J5.P$67
  Top 0.2: v31,93.41 18,106.41 18,160.01 20,162.01 | v254.27,93.4 270.37,109.5 270.37,159.01 268.38,161 266.96,161
  Route15 0.2: v31,93.41 v69,93.41 v69.01,93.4 v176.37,93.4 v254.27,93.4
  Bottom 0.17: 179.37,214.01 179.37,219 | 180.37,109.88 181.37,108.88 181.37,107.01 | J1.P$67 73,109.81 74,108.81 74,107.01 | J2.P$67 72,214.01 72,219.01
  Bottom 0.2: 72,219.01 67.41,223.6 50.64,223.6 46.78,219.74 46.78,137.78 43,133.99 43,97.41 47,93.41 v69,93.41 70,93.41 74,97.41 74,107.01 | J4.P$67 179.37,214 179.37,214.01 | 179.37,219 174.78,223.59 158.01,223.59 154.15,219.73 154.15,137.77 150.37,133.98 150.37,97.4 154.37,93.4 v176.37,93.4 177.37,93.4 181.37,97.4 181.37,107.01 | 180.37,109.88 J3.P$67
H1-15  (via drill 0.35)
  Route15 0.17: J6.P$98 263.67,163 257.02,163
  Route15 0.2: J5.P$98 v75,163.01 v75.01,163 v182.37,163 257.02,163
  Bottom 0.17: 181.49,115.52 181.38,115.41 181.38,109.39 J3.P$98 | 74.3,115.71 74.3,115.11 74.01,114.82 74.01,109.4 74.7,108.71
  Bottom 0.2: 74.7,108.71 J1.P$98 | 74.3,115.71 75,116.41 v75,163.01 J2.P$98 | 181.49,115.52 182.37,116.4 v182.37,163 J4.P$98
H1-16  (via drill 0.35)
  Top 0.17: J6.P$68 263.67,163 266.92,163 | J5.P$68 25.99,164.02 22.59,164.02 22.58,164.03 19.62,164.03
  Top 0.2: v30.6,91.41 17.6,104.41 17.6,162.01 19.62,164.03 | v254.67,91.4 270.77,107.5 270.77,161.01 268.78,163 266.92,163
  Route15 0.2: v30.6,91.41 v71,91.41 v71.01,91.4 v178.37,91.4 v254.67,91.4
  Bottom 0.17: 181.37,214 181.37,219 | 182.37,109.88 183.37,108.88 183.37,107.01 | J1.P$68 75,109.81 76,108.81 76,107.01 | J2.P$68 74,214.01 74,219.01
  Bottom 0.2: 74,219.01 69.01,224 50.48,224 46.38,219.9 46.38,137.94 42.6,134.16 42.6,95.81 47,91.41 v71,91.41 72,91.41 76,95.41 76,107.01 | J4.P$68 181.37,214 | 181.37,219 176.38,223.99 157.85,223.99 153.75,219.89 153.75,137.93 149.97,134.15 149.97,95.8 154.37,91.4 v178.37,91.4 179.37,91.4 183.37,95.4 183.37,107.01 | J3.P$68 182.37,109.88
H1-17  (via drill 0.35)
  Route15 0.17: J6.P$99 263.67,165 257,165
  Route15 0.2: J5.P$99 v77,165.01 v77.01,165 v184.37,165 257,165
  Bottom 0.17: 183.49,115.52 183.38,115.41 183.38,109.39 J3.P$99 | 76,115.41 76,109.41 76.7,108.71
  Bottom 0.2: 76.7,108.71 J1.P$99 | 76,115.41 77,116.41 v77,165.01 J2.P$99 | 183.49,115.52 184.37,116.4 v184.37,165 J4.P$99
H1-18  (via drill 0.35)
  Top 0.17: J6.P$69 263.67,165 267,165 | 19.19,166 26.01,166 J5.P$69
  Top 0.2: v30.2,89.41 17.2,102.41 17.2,164.01 19.19,166 | v255.07,89.4 271.17,105.5 271.17,163.01 269.18,165 267,165
  Route15 0.2: v30.2,89.41 v73,89.41 v73.01,89.4 v180.37,89.4 v255.07,89.4
  Bottom 0.17: 183.37,214 183.37,219 | J3.P$69 184.35,110.38 184.35,109.9 185.37,108.88 185.37,107.01 | J1.P$69 77,109.85 77.16,109.7 77.16,109.71 78,108.87 78,108.01 | J2.P$69 76,214.01 76,219.01
  Bottom 0.2: 76,219.01 70.61,224.4 50.31,224.4 45.98,220.07 45.98,138.11 42.2,134.32 42.2,94.21 47,89.41 v73,89.41 74,89.41 78,93.41 78,108.01 | J4.P$69 183.37,214 | 183.37,219 177.98,224.39 157.68,224.39 153.35,220.06 153.35,138.1 149.57,134.31 149.57,94.2 154.37,89.4 v180.37,89.4 181.37,89.4 185.37,93.4 185.37,107.01
H1-19  (via drill 0.35)
  Route15 0.17: J6.P$100 263.67,167 257.13,167
  Route15 0.2: J5.P$100 v79,167.01 v79.01,167 v186.37,167 257.13,167
  Bottom 0.17: 185.99,116.02 185.38,115.41 185.38,109.39 J3.P$100 | 78.01,115.42 78.01,109.4 J1.P$100
  Bottom 0.2: 78.01,115.42 79,116.41 v79,167.01 J2.P$100 | 185.99,116.02 186.37,116.4 v186.37,167 J4.P$100
H1-20  (via drill 0.35)
  Top 0.17: J6.P$70 263.67,167 266.92,167 | 21,168.01 26,168.01 J5.P$70
  Top 0.2: v29.8,87.41 16.8,100.41 16.8,166.01 18.8,168.01 21,168.01 | v255.47,87.4 271.57,103.5 271.57,165.01 269.58,167 266.92,167
  Route15 0.2: v29.8,87.41 v75,87.41 v75.01,87.4 v182.37,87.4 v255.47,87.4
  Bottom 0.17: 185.37,214 185.37,219 | J3.P$70 186.36,109.89 187.37,108.88 187.37,107.01 | J1.P$70 79,109.88 79.18,109.7 79.18,109.71 80,108.89 80,106.93 | J2.P$70 78,214.01 78,219.01
  Bottom 0.2: 78,219.01 72.21,224.8 50.14,224.8 45.56,220.21 45.56,138.25 41.8,134.49 41.8,92.61 47,87.41 v75,87.41 76,87.41 80,91.41 80,106.93 | J4.P$70 185.37,214 | 185.37,219 179.58,224.79 157.51,224.79 152.93,220.2 152.93,138.24 149.17,134.48 149.17,92.6 154.37,87.4 v182.37,87.4 183.37,87.4 187.37,91.4 187.37,107.01
H1-21  (via drill 0.35)
  Route15 0.17: J6.P$101 263.67,169 257.08,169
  Route15 0.2: J5.P$101 v81,169.01 v81.01,169 v188.37,169 257.08,169
  Bottom 0.17: 187.99,116.02 187.38,115.41 187.38,109.39 J3.P$101 | J1.P$101 80.01,109.4 80.01,114.91
  Bottom 0.2: 80.01,114.91 81,115.9 v81,169.01 J2.P$101 | 187.99,116.02 188.37,116.4 v188.37,169 J4.P$101
H1-22  (via drill 0.35)
  Top 0.17: J6.P$71 263.67,169 266.92,169 | 21,170.01 26,170.01 J5.P$71
  Top 0.2: v29.4,85.41 16.4,98.41 16.4,168.01 18.4,170.01 21,170.01 | J5.P$71 | v255.87,85.4 271.97,101.5 271.97,167.01 269.98,169 266.92,169
  Route15 0.2: v29.4,85.41 v77,85.41 v77.01,85.4 v184.37,85.4 v255.87,85.4
  Bottom 0.17: 187.37,214 187.37,219 | J3.P$71 188.37,109.88 189.37,108.88 189.37,107.01 | J1.P$71 81,109.81 82,108.81 82,106.01 | J2.P$71 80,214.01 80,219.01
  Bottom 0.2: 80,219.01 73.81,225.2 49.98,225.2 45.16,220.38 45.16,138.42 41.4,134.66 41.4,91.01 47,85.41 v77,85.41 78.1,85.41 82,89.31 82,106.01 | J4.P$71 187.37,214 | 187.37,219 181.18,225.19 157.35,225.19 152.53,220.37 152.53,138.41 148.77,134.65 148.77,91 154.37,85.4 v184.37,85.4 185.47,85.4 189.37,89.3 189.37,107.01
H1-23  (via drill 0.35)
  Route15 0.17: J6.P$102 263.67,171 257.12,171
  Route15 0.2: J5.P$102 v83,171.01 v83.01,171 v190.37,171 257.12,171
  Bottom 0.17: J3.P$102 189.37,109.4 189.37,116.01 | 82,109.41 82,115.01
  Bottom 0.2: J1.P$102 82,109.41 | 82,115.01 82,115.41 83,116.41 v83,171.01 J2.P$102 | 189.37,116.01 189.37,116.4 190.37,117.4 v190.37,171 J4.P$102
H1-24  (via drill 0.35)
  Top 0.17: J6.P$72 263.67,171 266.94,171 | 21,172.01 26,172.01 26.95,171.06
  Top 0.2: 26.95,171.06 J5.P$72 | v29,83.41 16,96.41 16,170.01 18,172.01 21,172.01 | v256.27,83.4 272.37,99.5 272.37,169.01 270.38,171 266.94,171
  Route15 0.2: v29,83.41 v79,83.41 v79.01,83.4 v186.37,83.4 v256.27,83.4
  Bottom 0.17: 189.37,214 189.37,218.9 | J3.P$72 190.37,109.83 190.43,109.77 190.43,109.82 191.37,108.88 191.37,107.01 | J1.P$72 83,109.86 84,108.87 84,107 | J2.P$72 82,214.01 82,218.91
  Bottom 0.2: 82,218.91 75.31,225.6 49.81,225.6 44.76,220.54 44.76,138.58 41,134.82 41,89.41 47,83.41 v79,83.41 80,83.41 84,87.41 84,107 | J4.P$72 189.37,214 | 189.37,218.9 182.68,225.59 157.18,225.59 152.13,220.53 152.13,138.57 148.37,134.81 148.37,89.4 154.37,83.4 v186.37,83.4 187.37,83.4 191.37,87.4 191.37,107.01
H1-25  (via drill 0.35)
  Route15 0.17: J6.P$103 263.67,173 257.1,173
  Route15 0.2: J5.P$103 v85,173.01 v85.01,173 v192.37,173 257.1,173
  Bottom 0.17: J3.P$103 191.37,109.4 191.37,116.01 | 84.33,115.74 84.01,115.42 84.01,109.4 J1.P$103
  Bottom 0.2: 84.33,115.74 85,116.41 v85,173.01 J2.P$103 | 191.37,116.01 191.37,172 v192.37,173 J4.P$103
H1-26  (via drill 0.35)
  Top 0.17: J6.P$73 263.67,173 266.89,173 | 21,174.01 26,174.01 26.93,173.08
  Top 0.2: 26.93,173.08 J5.P$73 | v28.6,81.41 15.6,94.41 15.6,172.01 17.6,174.01 21,174.01 | v256.67,81.4 272.77,97.5 272.77,171.01 270.78,173 266.89,173
  Route15 0.2: v28.6,81.41 v81,81.41 v81.01,81.4 v188.37,81.4 v256.67,81.4
  Bottom 0.17: 191.37,214.01 191.37,219 | 192.37,109.88 193.37,108.88 193.37,107.01 | J1.P$73 85,109.81 86,108.81 86,106.97 | J2.P$73 84,214.01 84,219.01
  Bottom 0.2: 84,219.01 77.01,226 49.65,226 44.36,220.71 44.36,138.75 40.6,134.99 40.6,87.81 47,81.41 v81,81.41 82.1,81.41 86,85.31 86,106.97 | J4.P$73 191.37,214 191.37,214.01 | 191.37,219 184.38,225.99 157.02,225.99 151.73,220.7 151.73,138.74 147.97,134.98 147.97,87.8 154.37,81.4 v188.37,81.4 189.47,81.4 193.37,85.3 193.37,107.01 | J3.P$73 192.37,109.88
H1-27  (via drill 0.35)
  Route15 0.17: J6.P$104 263.67,175 257.03,175
  Route15 0.2: J5.P$104 v87,175.01 v87.01,175 v194.37,175 257.03,175
  Bottom 0.17: J3.P$104 193.37,109.4 193.37,115.01 | 86.01,115.42 86.01,109.4 J1.P$104
  Bottom 0.2: 86.01,115.42 87,116.41 v87,175.01 J2.P$104 | 193.37,115.01 193.37,115.4 195.37,117.4 195.37,174 v194.37,175 J4.P$104
H1-28  (via drill 0.35)
  Top 0.17: J6.P$74 263.67,175 | 264,175 266.83,175 | 21,176.01 26,176.01 J5.P$74
  Top 0.2: v28.2,79.41 15.2,92.41 15.2,174.01 17.2,176.01 21,176.01 | v257.07,79.4 273.17,95.5 273.17,173.01 271.18,175 266.83,175 | 263.67,175 264,175
  Route15 0.2: v28.2,79.41 v83,79.41 v83.01,79.4 v190.37,79.4 v257.07,79.4
  Bottom 0.17: 193.37,214.01 193.36,214.02 193.36,219.01 193.18,219.19 | J3.P$74 194.37,109.88 195.37,108.88 195.37,107.01 | J1.P$74 87,109.81 88,108.81 88,106.98 | J2.P$74 86,214.01 86,219.01
  Bottom 0.2: 86,219.01 78.61,226.4 49.48,226.4 43.96,220.87 43.96,138.91 40.2,135.15 40.2,86.21 47,79.41 v83,79.41 84,79.41 88,83.41 88,106.98 | J4.P$74 193.37,214 193.37,214.01 | 193.18,219.19 185.98,226.39 156.85,226.39 151.33,220.86 151.33,138.9 147.57,135.14 147.57,86.2 154.37,79.4 v190.37,79.4 191.37,79.4 195.37,83.4 195.37,107.01
H1-29  (via drill 0.35)
  Route15 0.17: J6.P$105 263.67,177 257.13,177
  Route15 0.2: J5.P$105 v89,177.01 v89.01,177 v196.37,177 257.13,177
  Bottom 0.17: J3.P$105 195.37,109.4 195.37,115.01 | 88.16,115.57 88.01,115.42 88.01,109.4 88.2,109.21
  Bottom 0.2: J1.P$105 88.2,109.21 | 88.16,115.57 89,116.41 v89,177.01 J2.P$105 | 195.37,115.01 195.37,115.4 196.37,116.4 v196.37,177 J4.P$105
H1-30  (via drill 0.35)
  Top 0.17: J6.P$75 263.66,177.01 | 264,177 266.86,177 | 21,178.01 26,178.01 26.95,177.06
  Top 0.2: 26.95,177.06 J5.P$75 | v27.8,77.41 14.8,90.41 14.8,176.01 16.8,178.01 21,178.01 | v257.47,77.4 273.57,93.5 273.57,175.01 271.58,177 266.86,177 | 263.66,177.01 263.67,177 264,177
  Route15 0.2: v27.8,77.41 v85,77.41 v85.01,77.4 v192.37,77.4 v257.47,77.4
  Bottom 0.17: 195.37,214.01 195.36,214.02 195.36,219.01 195.18,219.19 | J3.P$75 196.37,109.88 197.37,108.88 197.37,107.01 | J1.P$75 89,109.81 90,108.81 90,107.21 | J2.P$75 88,214.01 88,219.01
  Bottom 0.2: 88,219.01 80.21,226.8 49.32,226.8 43.56,221.04 43.56,139.08 39.8,135.32 39.8,84.61 47,77.41 v85,77.41 86,77.41 90,81.41 90,107.21 | J4.P$75 195.37,214 195.37,214.01 | 195.18,219.19 187.58,226.79 156.69,226.79 150.93,221.03 150.93,139.07 147.17,135.31 147.17,84.6 154.37,77.4 v192.37,77.4 193.37,77.4 197.37,81.4 197.37,107.01
H1-31  (via drill 0.35)
  Route15 0.17: J6.P$106 263.67,179 257.08,179
  Route15 0.2: J5.P$106 v91,179.01 v91.01,179 v198.37,179 257.08,179
  Bottom 0.17: J3.P$106 197.37,109.4 197.37,115.01 | 90,115.41 90.01,115.4 90.01,109.42 90,109.41
  Bottom 0.2: J1.P$106 90,109.41 | 90,115.41 91,116.41 v91,179.01 J2.P$106 | 197.37,115.01 197.37,115.4 198.37,116.4 v198.37,179 J4.P$106
H1-32  (via drill 0.35)
  Top 0.17: J6.P$76 263.64,179.03 | 264,179 266.91,179 | 21,180.01 26,180.01 J5.P$76
  Top 0.2: v27.4,75.41 14.4,88.41 14.4,178.01 16.4,180.01 21,180.01 | v257.87,75.4 273.97,91.5 273.97,177.01 271.98,179 266.91,179 | 263.64,179.03 263.67,179 264,179
  Route15 0.2: v27.4,75.41 v87,75.41 v87.01,75.4 v194.37,75.4 v257.87,75.4
  Bottom 0.17: 197.37,214.01 197.37,219 | 199.38,106.97 199.38,108.85 198.37,109.86 198.37,110.01 | 92,107.01 92.01,107 92.01,108.86 91,109.86 J1.P$76 | J2.P$76 90,214.01 90,219.01
  Bottom 0.2: 90,219.01 81.81,227.2 49.15,227.2 43.1,221.14 43.1,139.19 39.4,135.49 39.4,83.01 47,75.41 v87,75.41 88,75.41 92,79.41 92,107.01 | J4.P$76 197.37,214 197.37,214.01 | 197.37,219 189.18,227.19 156.52,227.19 150.47,221.13 150.47,139.18 146.77,135.48 146.77,83 154.37,75.4 v194.37,75.4 195.37,75.4 199.38,79.41 199.38,106.97 | 198.37,110.01 J3.P$76
H1-33  (via drill 0.35)
  Route15 0.17: J6.P$107 263.67,181 257.01,181
  Route15 0.2: J5.P$107 v93,181.01 v93.01,181 v200.37,181 257.01,181
  Bottom 0.17: J3.P$107 199.37,109.4 199.37,115.4 | 92,115.41 92,109.41
  Bottom 0.2: 92,109.41 J1.P$107 | 92,115.41 93,116.41 v93,181.01 J2.P$107 | 199.37,115.4 200.37,116.4 v200.37,181 J4.P$107
H1-34  (via drill 0.35)
  Top 0.17: J6.P$77 263.6,181.07 | 264,181 266.9,181 | 21,182.01 26,182.01 J5.P$77
  Top 0.2: v27,73.41 14,86.41 14,180.01 16,182.01 21,182.01 | v258.27,73.4 274.37,89.5 274.37,179.01 272.38,181 266.9,181 | 263.6,181.07 263.67,181 264,181
  Route15 0.2: v27,73.41 v89,73.41 v89.01,73.4 v196.37,73.4 v258.27,73.4
  Bottom 0.17: 199.37,214.01 199.37,219 | 201.37,108.84 201.37,107.01 | J1.P$77 93,109.81 94,108.81 94,107.48 | J2.P$77 92,214.01 92,219.01
  Bottom 0.2: 92,219.01 83.41,227.6 48.98,227.6 42.7,221.31 42.7,139.35 39,135.65 39,81.41 47,73.41 v89,73.41 90,73.41 94,77.41 94,107.48 | J4.P$77 199.37,214 199.37,214.01 | 199.37,219 190.78,227.59 156.35,227.59 150.07,221.3 150.07,139.34 146.37,135.64 146.37,81.4 154.37,73.4 v196.37,73.4 197.37,73.4 201.37,77.4 201.37,107.01 | J3.P$77 200.37,109.84 201.37,108.84
H1-35  (via drill 0.35)
  Route15 0.17: J6.P$108 263.67,183 256.95,183
  Route15 0.2: J5.P$108 v95,183.01 v95.01,183 v202.37,183 256.95,183
  Bottom 0.17: J3.P$108 201.37,109.4 201.37,115.01 | 94,115.41 94,109.41
  Bottom 0.2: 94,109.41 J1.P$108 | 94,115.41 95,116.41 v95,183.01 J2.P$108 | 201.37,115.01 201.37,115.4 202.37,116.4 v202.37,183 J4.P$108
H1-36  (via drill 0.35)
  Top 0.17: J6.P$78 263.67,183 | 264,183 266.81,183 | 21,184.01 26,184.01 J5.P$78
  Top 0.2: v26.6,71.41 13.6,84.41 13.6,182.01 15.6,184.01 21,184.01 | v258.67,71.4 274.77,87.5 274.77,181.01 272.78,183 266.81,183 | 263.67,183 264,183
  Route15 0.2: v26.6,71.41 v91,71.41 v91.01,71.4 v198.37,71.4 v258.67,71.4
  Bottom 0.17: 201.37,214.01 201.37,219 | J3.P$78 202.37,109.86 203.37,108.86 203.37,106.01 | J1.P$78 95,109.81 96,108.81 96,107.56 | J2.P$78 94,214.01 94,219.01
  Bottom 0.2: 94,219.01 85.01,228 48.82,228 42.3,221.48 42.3,139.52 38.6,135.82 38.6,79.81 47,71.41 v91,71.41 92,71.41 96,75.41 96,107.56 | J4.P$78 201.37,214 201.37,214.01 | 201.37,219 192.38,227.99 156.19,227.99 149.67,221.47 149.67,139.51 145.97,135.81 145.97,79.8 154.37,71.4 v198.37,71.4 199.37,71.4 203.37,75.4 203.37,106.01
H1-37  (via drill 0.35)
  Route15 0.17: J6.P$109 263.67,185 257.15,185
  Route15 0.2: J5.P$109 v97,185.01 v97.01,185 v204.37,185 257.15,185
  Bottom 0.17: 203.49,115.52 203.38,115.41 203.38,109.39 J3.P$109 | 96,115.41 96,109.41
  Bottom 0.2: 96,109.41 J1.P$109 | 96,115.41 97,116.41 v97,185.01 J2.P$109 | 203.49,115.52 204.37,116.4 v204.37,185 J4.P$109
H1-38  (via drill 0.35)
  Top 0.17: J6.P$79 263.67,185 | 264,185 266.94,185 | 21,186.01 26,186.01 J5.P$79
  Top 0.2: v26.2,69.41 13.2,82.41 13.2,184.01 15.2,186.01 21,186.01 | v259.07,69.4 275.17,85.5 275.17,183.01 273.18,185 266.94,185 | 263.67,185 264,185
  Route15 0.2: v26.2,69.41 v93,69.41 v93.01,69.4 v200.37,69.4 v259.07,69.4
  Bottom 0.17: 203.37,214.01 203.37,219 | J3.P$79 204.37,109.88 205.37,108.88 205.37,107.01 | 97,110.01 97,109.81 98,108.81 98,107.46 | J2.P$79 96,214.01 96,219.01
  Bottom 0.2: 96,219.01 86.61,228.4 48.65,228.4 41.9,221.64 41.9,139.68 38.2,135.98 38.2,78.21 47,69.41 v93,69.41 94,69.41 98,73.41 98,107.46 | J1.P$79 97,110.01 | J4.P$79 203.37,214 203.37,214.01 | 203.37,219 193.98,228.39 156.02,228.39 149.27,221.63 149.27,139.67 145.57,135.97 145.57,78.2 154.37,69.4 v200.37,69.4 201.37,69.4 205.37,73.4 205.37,107.01
H1-39  (via drill 0.35)
  Route15 0.17: J6.P$110 263.67,187 257.32,187
  Route15 0.2: J5.P$110 v99,187.01 v99.01,187 v206.37,187 257.32,187
  Bottom 0.17: 205.37,115.4 205.37,109.4 J3.P$110 | 98,115.41 98,109.41
  Bottom 0.2: J1.P$110 98,109.41 | 98,115.41 99,116.41 v99,187.01 J2.P$110 | 205.37,115.4 206.37,116.4 v206.37,187 J4.P$110
H1-40  (via drill 0.35)
  Top 0.17: J6.P$80 263.67,187 | 264,187 266.91,187 | 21,188.01 26,188.01 J5.P$80
  Top 0.2: v25.8,67.41 12.8,80.41 12.8,186.01 14.8,188.01 21,188.01 | v259.47,67.4 275.57,83.5 275.57,185.01 273.58,187 266.91,187 | 263.67,187 264,187
  Route15 0.2: v25.8,67.41 v95,67.41 v95.01,67.4 v202.37,67.4 v259.47,67.4
  Bottom 0.17: 205.37,214.01 205.36,214.02 205.36,219.01 205.18,219.19 | 207.37,108.01 207.36,108.02 207.36,108.81 206.37,109.8 206.37,110.01 | J1.P$80 99,109.87 100,108.87 100,107.01 | J2.P$80 98,214.01 98,219.01
  Bottom 0.2: 98,219.01 88.21,228.8 48.49,228.8 41.5,221.81 41.5,139.85 37.8,136.15 37.8,76.61 47,67.41 v95,67.41 96,67.41 100,71.41 100,107.01 | J4.P$80 205.37,214 205.37,214.01 | 205.18,219.19 195.58,228.79 155.86,228.79 148.87,221.8 148.87,139.84 145.17,136.14 145.17,76.6 154.37,67.4 v202.37,67.4 203.37,67.4 207.37,71.4 207.37,108.01 | 206.37,110.01 J3.P$80
H1-41  (via drill 0.35)
  Route15 0.17: J6.P$111 263.67,189 257.34,189
  Route15 0.2: J5.P$111 v101,189.01 v101.01,189 v208.37,189 257.34,189
  Bottom 0.17: J3.P$111 207.37,109.4 207.37,115.01 | 100,115.41 100,109.41
  Bottom 0.2: J1.P$111 100,109.41 | 100,115.41 101,116.41 v101,189.01 J2.P$111 | 207.37,115.01 207.37,115.4 208.37,116.4 v208.37,189 J4.P$111
H1-42  (via drill 0.35)
  Top 0.17: J6.P$81 263.63,189.04 | 264,189 266.92,189 | 21,190.01 26,190.01 26.95,189.06
  Top 0.2: 26.95,189.06 J5.P$81 | v25.4,65.41 12.4,78.41 12.4,188.01 14.4,190.01 21,190.01 | v259.87,65.4 275.97,81.5 275.97,187.01 274,188.98 274,189 266.92,189 | 263.63,189.04 263.67,189 264,189
  Route15 0.2: v25.4,65.41 v97,65.41 v97.01,65.4 v204.37,65.4 v259.87,65.4
  Bottom 0.17: 207.37,214.01 207.36,214.02 207.36,218.91 207.13,219.14 | 208.37,109.8 209.37,108.8 209.37,106.01 | 102,108.01 101.99,108.02 101.99,108.82 101,109.81 101,110.01 | J2.P$81 100,214.01 100,218.91
  Bottom 0.2: 100,218.91 89.71,229.2 48.32,229.2 41.1,221.97 41.1,140.01 37.4,136.31 37.4,75.01 47,65.41 v97,65.41 98,65.41 102,69.41 102,108.01 | 101,110.01 J1.P$81 | J4.P$81 207.37,214 207.37,214.01 | 207.13,219.14 197.08,229.19 155.69,229.19 148.47,221.96 148.47,140 144.77,136.3 144.77,75 154.37,65.4 v204.37,65.4 205.37,65.4 209.37,69.4 209.37,106.01 | J3.P$81 208.37,109.8
H1-43  (via drill 0.35)
  Top 0.17: 103,209.01 J2.P$112
  Top 0.2: v103,191.01 103,209.01
  Route15 0.17: J6.P$112 263.67,191 257.24,191
  Route15 0.2: J5.P$112 v103,191.01 v103.01,191 209.37,191 209.38,190.99 v210.37,191 257.24,191
  Bottom 0.17: 209.49,115.52 209.38,115.41 209.38,109.39 J3.P$112 | 102,115.41 102,109.41
  Bottom 0.2: 102,109.41 J1.P$112 | 102,115.41 103,116.41 v103,191.01 | 209.49,115.52 210.37,116.4 v210.37,191 J4.P$112
H1-44  (via drill 0.35)
  Top 0.17: J6.P$82 263.67,191 | 264,191 266.89,191 | 21,192.01 26,192.01 J5.P$82
  Top 0.2: v25,63.41 12,76.41 12,190.01 14,192.01 21,192.01 | v260.27,63.4 276.37,79.5 276.37,189.01 274.38,191 266.89,191 | 263.67,191 264,191
  Route15 0.2: v25,63.41 v99,63.41 v99.01,63.4 v206.37,63.4 v260.27,63.4
  Bottom 0.17: 209.37,214.01 209.37,219 | J3.P$82 210.37,109.91 210.36,109.9 210.36,109.89 211.37,108.88 211.37,107.01 | 104,108.01 104,108.82 103,109.82 J1.P$82 | J2.P$82 102,214.01 102,219.01
  Bottom 0.2: 102,219.01 91.4,229.61 48.17,229.61 40.7,222.14 40.7,140.18 37,136.48 37,73.41 47,63.41 v99,63.41 100,63.41 104,67.41 104,108.01 | J4.P$82 209.37,214 209.37,214.01 | 209.37,219 198.77,229.6 155.54,229.6 148.07,222.13 148.07,140.17 144.37,136.47 144.37,73.4 154.37,63.4 v206.37,63.4 207.37,63.4 211.37,67.4 211.37,107.01
H1-45  (via drill 0.35)
  Route15 0.17: J6.P$113 263.67,193 257.25,193
  Route15 0.2: J5.P$113 v105,193.01 v105.01,193 v212.37,193 257.25,193
  Bottom 0.17: J3.P$113 211.37,109.4 211.37,115.4 | 104,115.41 104,109.41
  Bottom 0.2: 104,109.41 J1.P$113 | 104,115.41 105,116.41 v105,193.01 J2.P$113 | 211.37,115.4 212.37,116.4 v212.37,193 J4.P$113
H1-46  (via drill 0.35)
  Top 0.17: J6.P$83 263.62,193.06 | 264,193 266.92,193 | 21,194.01 26,194.01 J5.P$83
  Top 0.2: J5.P$83 | v24.8,62.41 11.6,75.61 11.6,192.01 13.6,194.01 21,194.01 | v260.47,62.4 276.77,78.7 276.77,191.01 274.78,193 266.92,193 | 263.62,193.06 263.67,193 264,193
  Route15 0.2: v24.8,62.41 v100,62.41 v100.01,62.4 v207.37,62.4 v260.47,62.4
  Bottom 0.17: 211.37,214.01 211.37,219 | 212.37,109.88 213.37,108.88 213.37,107.01 | 106,108.01 106,108.87 105,109.86 J1.P$83 | J2.P$83 104,214.01 104,219.01
  Bottom 0.2: 104,219.01 93,230.01 48,230.01 40.3,222.31 40.3,140.35 36.6,136.64 36.6,72.81 47,62.41 v100,62.41 101,62.41 106,67.41 106,108.01 | J4.P$83 211.37,214 211.37,214.01 | 211.37,219 200.37,230 155.38,230 147.67,222.3 147.67,140.33 143.97,136.63 143.97,72.8 154.37,62.4 v207.37,62.4 208.37,62.4 213.37,67.4 213.37,107.01 | J3.P$83 212.37,109.88
H1-47  (via drill 0.35)
  Route15 0.17: J6.P$114 263.67,195 257.32,195
  Route15 0.2: J5.P$114 v107,195.01 v107.01,195 v214.37,195 257.32,195
  Bottom 0.17: J3.P$114 213.37,109.4 213.37,115.01 | 106,115.41 106,109.41
  Bottom 0.2: J1.P$114 106,109.41 | 106,115.41 107,116.41 v107,195.01 J2.P$114 | 213.37,115.01 213.37,115.4 214.37,116.4 v214.37,195 J4.P$114
H1-48  (via drill 0.35)
  Top 0.17: J6.P$84 263.67,195 267,195 | 22,196.01 26,196.01 26.95,195.06
  Top 0.2: 26.95,195.06 J5.P$84 | v24.6,61.41 11.15,74.86 11.15,194.01 13.15,196.01 22,196.01 | v260.67,61.4 277.17,77.9 277.17,193.01 275.18,195 267,195
  Route15 0.2: v24.6,61.41 v101,61.41 v101.01,61.4 v208.37,61.4 v260.67,61.4
  Bottom 0.17: 213.37,214.01 213.36,214.02 213.36,219.01 213.18,219.19 | J3.P$84 214.37,109.86 215.37,108.86 215.37,107.01 | 108,108.01 108,108.87 107,109.87 J1.P$84 | J2.P$84 106,214.01 106,219.01
  Bottom 0.2: 106,219.01 94.6,230.41 47.84,230.41 39.9,222.47 39.9,140.51 36.2,136.81 36.2,72.21 47,61.41 v101,61.41 102,61.41 108,67.41 108,108.01 | J4.P$84 213.37,214 213.37,214.01 | 213.18,219.19 201.97,230.4 155.21,230.4 147.27,222.46 147.27,140.5 143.57,136.8 143.57,72.2 154.37,61.4 v208.37,61.4 209.37,61.4 215.37,67.4 215.37,107.01
H1-49  (via drill 0.35)
  Route15 0.17: J6.P$115 263.67,197 257.13,197
  Route15 0.2: J5.P$115 v109,197.01 v109.01,197 v216.37,197 257.13,197
  Bottom 0.17: 215.49,115.52 215.38,115.41 215.38,109.39 J3.P$115 | 108,115.41 108,109.41
  Bottom 0.2: 108,109.41 J1.P$115 | 108,115.41 109,116.41 v109,197.01 J2.P$115 | 215.49,115.52 216.37,116.4 v216.37,197 J4.P$115
H1-50  (via drill 0.35)
  Top 0.17: J6.P$85 263.6,197.07 | 264,197 266.94,197 | 21,198.01 26,198.01 26.92,197.08
  Top 0.2: 26.92,197.08 J5.P$85 | v24.4,60.41 10.75,74.06 10.75,196.01 12.75,198.01 21,198.01 | v260.87,60.4 277.57,77.1 277.57,195.01 275.58,197 266.94,197 | 263.6,197.07 263.67,197 264,197
  Route15 0.2: v24.4,60.41 v102,60.41 v102.01,60.4 v209.37,60.4 v260.87,60.4
  Bottom 0.17: 215.37,214 215.36,214.01 215.36,219.01 215.18,219.19 | 216.37,109.86 217.37,108.86 217.37,106.01 | 110,108.01 110,108.87 109.06,109.81 109.06,109.77 109,109.83 J1.P$85 | J2.P$85 108,214.01 108,219.01
  Bottom 0.2: 108,219.01 96.2,230.81 47.67,230.81 39.5,222.64 39.5,140.68 35.8,136.98 35.8,71.61 47,60.41 v102,60.41 103,60.41 110,67.41 110,108.01 | J4.P$85 215.37,214 | 215.18,219.19 203.57,230.8 155.04,230.8 146.87,222.63 146.87,140.67 143.17,136.97 143.17,71.6 154.37,60.4 v209.37,60.4 210.37,60.4 217.37,67.4 217.37,106.01 | J3.P$85 216.37,109.86
H1-51  (via drill 0.35)
  Route15 0.17: J6.P$116 263.67,199 257.22,199
  Route15 0.2: J5.P$116 v111,199.01 v111.01,199 v218.37,199 257.22,199
  Bottom 0.17: J3.P$116 217.37,109.4 217.37,115.4 | 110,115.41 110,109.41
  Bottom 0.2: 110,109.41 J1.P$116 | 110,115.41 111,116.41 v111,199.01 J2.P$116 | 217.37,115.4 218.37,116.4 v218.37,199 J4.P$116
H1-52  (via drill 0.35)
  Top 0.17: J6.P$86 263.67,199 | 264,199 267.05,199 | 21,200.01 26,200.01 J5.P$86
  Top 0.2: v24.2,59.41 10.35,73.26 10.35,198.01 12.35,200.01 21,200.01 | v261.07,59.4 277.97,76.3 277.97,197.01 275.98,199 267.05,199 | 263.67,199 264,199
  Route15 0.2: v24.2,59.41 v103,59.41 v103.01,59.4 v210.37,59.4 v261.07,59.4
  Bottom 0.17: 217.37,214.01 217.36,214.02 217.36,218.91 217.13,219.14 | J3.P$86 218.37,109.83 219.37,108.83 219.37,107.01 | 112,108.01 112,108.87 111,109.87 J1.P$86 | J2.P$86 110,214.01 110,218.91
  Bottom 0.2: 110,218.91 97.7,231.21 47.51,231.21 39.1,222.8 39.1,140.84 35.4,137.14 35.4,71.01 47,59.41 v103,59.41 104,59.41 112,67.41 112,108.01 | J4.P$86 217.37,214 217.37,214.01 | 217.13,219.14 205.07,231.2 154.88,231.2 146.47,222.79 146.47,140.83 142.77,137.13 142.77,71 154.37,59.4 v210.37,59.4 211.37,59.4 219.37,67.4 219.37,107.01
H2-1  (via drill 0.35)
  Top 0.2: J2.P$31 59,217.01 59,220.01 57.81,221.2 51.64,221.2 49.18,218.74 49.18,136.78 45.4,133 45.4,108.01 49,104.41 v58,104.41 59,104.41 59.66,105.07 59.66,111.07 J1.P$31 | J4.P$31 166.37,217 166.37,220 165.18,221.19 159.01,221.19 156.55,218.73 156.55,136.77 152.77,132.99 152.77,108 156.37,104.4 v165.37,104.4 166.37,104.4 167.02,105.05 167.02,111.05 J3.P$31
  Route15 0.2: J5.P$31 25,111.41 32,104.41 v58,104.41 v58.01,104.4 v165.37,104.4 v251.37,104.4
  Bottom 0.2: v251.37,104.4 260.67,113.7 J6.P$31
H2-2  (via drill 0.35)
  Top 0.17: 62,209.01 62,216.01 | 169.37,216 169.37,209.01
  Top 0.2: 62,216.01 J2.P$1 | 62,209.01 v62,150.01 62,116.41 61,115.41 J1.P$1 | J4.P$1 169.37,216 | 169.37,209.01 v169.37,150 169.37,116.4 168.37,115.4 J3.P$1
  Route15 0.17: J5.P$1 24,150.01 30.75,150.01
  Route15 0.2: 30.75,150.01 v62,150.01 v62.01,150 v169.37,150 J6.P$1
H2-3  (via drill 0.35)
  Top 0.17: 62,219.01 62,217.01 62.01,217 62.01,216.6 63,215.61 J2.P$32 | 169.37,219 169.37,217.01 169.38,217 169.38,216.59 170.37,215.6 J4.P$32 | 62,111.01 62,106.01 | 169.37,111.4 169.37,106.01
  Top 0.2: 62,219.01 59.41,221.6 51.47,221.6 48.78,218.91 48.78,136.95 45,133.17 45,105.51 48.1,102.41 v60,102.41 61,102.41 62,103.41 62,106.01 | J1.P$32 62,111.41 62,111.01 | 169.37,219 166.78,221.59 158.84,221.59 156.15,218.9 156.15,136.94 152.37,133.16 152.37,105.5 155.47,102.4 v167.37,102.4 168.37,102.4 169.37,103.4 169.37,106.01 | J3.P$32 169.37,111.4
  Route15 0.2: v32.8,102.41 v60,102.41 v60.01,102.4 v167.37,102.4 v252.57,102.4
  Bottom 0.17: J5.P$32 24,150.01 21.9,150.01 | J6.P$32 261.27,152 262.27,151 266,151
  Bottom 0.2: v32.8,102.41 20,115.21 20,149.01 21,150.01 21.9,150.01 | v252.57,102.4 268.37,118.2 268.37,150.01 267.38,151 266,151
H2-4  (via drill 0.35)
  Top 0.17: 64,209.01 64,216.01 | 171.37,209.01 171.37,216
  Top 0.2: 64,216.01 J2.P$2 | J1.P$2 63,115.41 64,116.41 v64,152.01 64,209.01 | J4.P$2 171.37,216 | J3.P$2 170.37,115.4 171.37,116.4 v171.37,152 171.37,209.01
  Route15 0.17: J5.P$2 24,152.01 30.89,152.01
  Route15 0.2: 30.89,152.01 v64,152.01 v64.01,152 v171.37,152 J6.P$2
H2-5  (via drill 0.35)
  Top 0.17: 171.37,219.1 171.36,219.09 171.36,217.01 171.38,216.99 171.38,216.59 172.37,215.6 J4.P$33 | 64,111.01 64,106.01 | 171.37,106.01 171.37,111.4 171.49,111.52 | J2.P$33 65,215.55 64,216.55 64,219.11
  Top 0.2: 64,219.11 61.11,222 51.31,222 48.38,219.07 48.38,137.12 44.6,133.33 44.6,103.81 48,100.41 v62,100.41 63,100.41 64,101.41 64,106.01 | J1.P$33 64,111.41 64,111.01 | 171.37,219.1 168.48,221.99 158.68,221.99 155.75,219.06 155.75,137.11 151.97,133.32 151.97,103.8 155.37,100.4 v169.37,100.4 170.37,100.4 171.37,101.4 171.37,106.01 | 171.49,111.52 J3.P$33
  Route15 0.2: v32.4,100.41 v62,100.41 v62.01,100.4 v169.37,100.4 v252.97,100.4
  Bottom 0.17: J5.P$33 24,152.01 21,152.01 | J6.P$33 260.68,154 261.68,153 266,153
  Bottom 0.2: v32.4,100.41 19.6,113.21 19.6,150.61 21,152.01 | v252.97,100.4 268.77,116.2 268.77,152.01 267.78,153 266,153
H2-6  (via drill 0.35)
  Top 0.17: 66,209.01 66,216.01 | 173.37,216 173.37,209.01
  Top 0.2: J1.P$3 65,115.41 66,116.41 v66,154.01 66,209.01 | 66,216.01 J2.P$3 | J3.P$3 172.37,115.4 173.37,116.4 v173.37,154 173.37,209.01 | J4.P$3 173.37,216
  Route15 0.17: J5.P$3 24,154.01 30.89,154.01
  Route15 0.2: 30.89,154.01 v66,154.01 v66.01,154 v173.37,154 J6.P$3
H2-7  (via drill 0.35)
  Top 0.17: 66,219.01 66,217.01 66.01,217 66.01,216.6 67,215.61 J2.P$34 | 173.37,219 173.37,217.01 173.38,217 173.38,216.59 174.37,215.6 J4.P$34 | 66,111.01 66,106.01 | 173.37,111.01 173.37,106.01
  Top 0.2: 66,219.01 62.61,222.4 51.14,222.4 47.98,219.24 47.98,137.28 44.2,133.5 44.2,102.21 48,98.41 v64,98.41 65,98.41 66,99.41 66,106.01 | J1.P$34 66,111.41 66,111.01 | 173.37,219 169.98,222.39 158.51,222.39 155.35,219.23 155.35,137.27 151.57,133.49 151.57,102.2 155.37,98.4 v171.37,98.4 172.37,98.4 173.37,99.4 173.37,106.01 | J3.P$34 173.37,111.4 173.37,111.01
  Route15 0.2: v32,98.41 v64,98.41 v64.01,98.4 v171.37,98.4 v253.28,98.4
  Bottom 0.17: J5.P$34 24,154.01 21.93,154.01 | J6.P$34 261.66,155 266,155
  Bottom 0.2: v32,98.41 31.98,98.41 19.2,111.19 19.2,152.21 21,154.01 21.93,154.01 | v253.28,98.4 269.17,114.29 269.17,153.01 267.18,155 266,155
H2-8  (via drill 0.35)
  Top 0.17: 68,209.01 68,216.01 | 175.37,216 175.37,209.01
  Top 0.2: 68,216.01 J2.P$4 | 68,209.01 v68,156.01 68,116.41 67,115.41 J1.P$4 | J4.P$4 175.37,216 | 175.37,209.01 v175.37,156 175.37,116.4 174.37,115.4 J3.P$4
  Route15 0.17: J5.P$4 24,156.01 30.91,156.01
  Route15 0.2: 30.91,156.01 v68,156.01 v68.01,156 v175.37,156 J6.P$4
H2-10  (via drill 0.35)
  Top 0.17: 70,209.01 70,216.01 | 177.37,216 177.37,209.01
  Top 0.2: J1.P$5 69,115.41 70,116.41 v70,158.01 70,209.01 | 70,216.01 J2.P$5 | J3.P$5 176.37,115.4 177.37,116.4 v177.37,158 177.37,209.01 | J4.P$5 177.37,216
  Route15 0.17: J5.P$5 24,158.01 30.92,158.01
  Route15 0.2: 30.92,158.01 v70,158.01 v70.01,158 v177.37,158 J6.P$5
H2-11  (via drill 0.35)
  Top 0.17: 70,219.01 70,217.01 70.01,217 70.01,216.6 71,215.61 J2.P$36 | 177.37,219 177.37,217.01 177.38,217 177.38,216.59 178.37,215.6 J4.P$36 | 70,111.01 70,106.01 | 177.37,106.01 177.37,111.4
  Top 0.2: 70,219.01 66.21,222.8 50.97,222.8 47.58,219.41 47.58,137.45 43.8,133.66 43.8,99.71 47.1,96.41 v66,96.41 67,96.41 70,99.41 70,106.01 | J1.P$36 70,111.41 70,111.01 | 177.37,219 173.58,222.79 158.34,222.79 154.95,219.4 154.95,137.44 151.17,133.65 151.17,99.7 154.47,96.4 v173.37,96.4 174.37,96.4 177.37,99.4 177.37,106.01 | 177.37,111.4 J3.P$36
  Route15 0.2: v31.6,96.41 v66,96.41 v66.01,96.4 v173.37,96.4 v253.67,96.4
  Bottom 0.17: J5.P$36 24,158.01 20.95,158.01 | J6.P$36 260.67,159.98 261.65,159 266,159
  Bottom 0.2: v31.6,96.41 31.41,96.41 18.8,109.02 18.8,155.86 20.95,158.01 | v253.67,96.4 269.57,112.3 269.57,157.01 267.58,159 266,159
H2-12  (via drill 0.35)
  Top 0.17: 72,209.01 72,216.01 | 179.18,216.19 179.37,216 179.37,209.01
  Top 0.2: 72,216.01 J2.P$6 | 72,209.01 v72,160.01 72,116.41 71,115.41 J1.P$6 | J4.P$6 179.18,216.19 | 179.37,209.01 v179.37,160 179.37,116.4 178.37,115.4 J3.P$6
  Route15 0.17: J5.P$6 24,160.01 30.98,160.01
  Route15 0.2: 30.98,160.01 v72,160.01 v72.01,160 v179.37,160 J6.P$6
H2-13  (via drill 0.35)
  Top 0.17: 72,219.01 72,217.01 72.01,217 72.01,216.6 73,215.61 J2.P$37 | 179.37,219 179.37,217.01 179.38,217 179.38,216.59 180.37,215.6 J4.P$37 | 72,111.01 72,106.01 | 179.37,111.4 179.37,106.01
  Top 0.2: 72,219.01 67.81,223.2 50.81,223.2 47.18,219.57 47.18,137.61 43.4,133.83 43.4,98.11 47.1,94.41 v68,94.41 69,94.41 72,97.41 72,106.01 | J1.P$37 72,111.41 72,111.01 | 179.37,219 175.18,223.19 158.18,223.19 154.55,219.56 154.55,137.6 150.77,133.82 150.77,98.1 154.47,94.4 v175.37,94.4 176.37,94.4 179.37,97.4 179.37,106.01 | J3.P$37 179.37,111.4
  Route15 0.2: v31.2,94.41 v68,94.41 v68.01,94.4 v175.37,94.4 v254.07,94.4
  Bottom 0.17: J5.P$37 24,160.01 22,160.01 | J6.P$37 261.66,161 266,161
  Bottom 0.2: v31.2,94.41 18.4,107.21 18.4,158.01 20.4,160.01 22,160.01 | v254.07,94.4 269.97,110.3 269.97,159.01 267.98,161 266,161
H2-15  (via drill 0.35)
  Top 0.17: 74,219.01 74,217.01 74.01,217 74.01,216.6 75,215.61 J2.P$38 | 181.37,216 181.37,219 | 74,111.01 74,106.01 | 181.37,106.01 181.37,111.4
  Top 0.2: 74,219.01 69.41,223.6 50.64,223.6 46.78,219.74 46.78,137.78 43,133.99 43,96.51 47.1,92.41 v70,92.41 71,92.41 74,95.41 74,106.01 | J1.P$38 74,111.41 74,111.01 | J4.P$38 181.37,216 | 181.37,219 176.78,223.59 158.01,223.59 154.15,219.73 154.15,137.77 150.37,133.98 150.37,96.5 154.47,92.4 v177.37,92.4 178.37,92.4 181.37,95.4 181.37,106.01 | 181.37,111.4 J3.P$38
  Route15 0.2: v30.8,92.41 v70,92.41 v70.01,92.4 v177.37,92.4 v254.47,92.4
  Bottom 0.17: J5.P$38 24,162.01 22,162.01 | J6.P$38 261.67,163 266.02,163
  Bottom 0.2: v30.8,92.41 18,105.21 18,160.01 20,162.01 22,162.01 | v254.47,92.4 270.37,108.3 270.37,161.01 268.38,163 266.02,163
H2-16  (via drill 0.35)
  Top 0.17: 76,209.01 76,216.01 | 183.37,216 183.37,209.01
  Top 0.2: J1.P$8 75,115.41 76,116.41 v76,164.01 76,209.01 | 76,216.01 J2.P$8 | J3.P$8 182.37,115.4 183.37,116.4 v183.37,164 183.37,209.01 | J4.P$8 183.37,216
  Route15 0.17: J5.P$8 24,164.01 31.08,164.01
  Route15 0.2: 31.08,164.01 v76,164.01 v76.01,164 v183.37,164 J6.P$8
H2-18  (via drill 0.35)
  Top 0.17: 78,209.01 78,216.01 | 185.37,216 185.37,209.01
  Top 0.2: J1.P$9 77,115.41 78,116.41 v78,166.01 78,209.01 | 78,216.01 J2.P$9 | J3.P$9 184.37,115.4 185.37,116.4 v185.37,166 185.37,209.01 | J4.P$9 185.37,216
  Route15 0.17: J5.P$9 24,166.01 31.01,166.01
  Route15 0.2: 31.01,166.01 v78,166.01 v78.01,166 v185.37,166 J6.P$9
H2-19  (via drill 0.35)
  Top 0.17: 78,219.01 78,217.01 78.01,217 78.01,216.6 79,215.61 J2.P$40 | 185.37,219 185.37,217.01 185.38,217 185.38,216.59 186.37,215.6 J4.P$40 | 78,111.01 78,106.01 | 185.37,106.01 185.37,111.4
  Top 0.2: 78,219.01 73.01,224 50.48,224 46.38,219.9 46.38,137.94 42.6,134.16 42.6,94.91 47.1,90.41 v72,90.41 73,90.41 78,95.41 78,106.01 | J1.P$40 78,111.41 78,111.01 | 185.37,219 180.38,223.99 157.85,223.99 153.75,219.89 153.75,137.93 149.97,134.15 149.97,94.9 154.47,90.4 v179.37,90.4 180.37,90.4 185.37,95.4 185.37,106.01 | 185.37,111.4 J3.P$40
  Route15 0.2: v30.4,90.41 v72,90.41 v72.01,90.4 v179.37,90.4 v254.87,90.4
  Bottom 0.17: J5.P$40 24,166.01 22,166.01 | J6.P$40 261.67,167 266.06,167
  Bottom 0.2: v30.4,90.41 17.6,103.21 17.6,163.01 20.6,166.01 22,166.01 | v254.87,90.4 270.77,106.3 270.77,165.01 268.78,167 266.06,167
H2-20  (via drill 0.35)
  Top 0.17: 80,216.01 80,209.01 | 187.18,216.19 187.37,216 187.37,209.01
  Top 0.2: J2.P$10 80,216.01 | 80,209.01 v80,168.01 80,116.41 79,115.41 J1.P$10 | J4.P$10 187.18,216.19 | 187.37,209.01 v187.37,168 187.37,116.4 186.37,115.4 J3.P$10
  Route15 0.17: J5.P$10 24,168.01 31.04,168.01
  Route15 0.2: 31.04,168.01 v80,168.01 v80.01,168 v187.37,168 J6.P$10
H2-31  (via drill 0.35)
  Top 0.17: 90,219.01 90,217.01 90.01,217 90.01,216.6 91,215.61 J2.P$46 | 197.37,216 197.37,219 | 90,111.01 90,106.01 | 197.37,111.4 197.37,106.01
  Top 0.2: 90,219.01 84.61,224.4 50.31,224.4 45.98,220.07 45.98,138.11 42.2,134.32 42.2,93.31 47.1,88.41 v74,88.41 75,88.41 90,103.41 90,106.01 | 90,111.01 90,111.41 J1.P$46 | J4.P$46 197.37,216 | 197.37,219 191.98,224.39 157.68,224.39 153.35,220.06 153.35,138.1 149.57,134.31 149.57,93.3 154.47,88.4 v181.37,88.4 182.37,88.4 197.37,103.4 197.37,106.01 | J3.P$46 197.37,111.4
  Route15 0.2: v30,88.41 v74,88.41 v74.01,88.4 v181.37,88.4 v255.27,88.4
  Bottom 0.17: J5.P$46 24,178.01 22,178.01 | J6.P$46 261.67,179 266.12,179
  Bottom 0.2: v30,88.41 17.2,101.21 17.2,176.01 19.2,178.01 22,178.01 | v255.27,88.4 271.17,104.3 271.17,177.01 269.18,179 266.12,179
H2-33  (via drill 0.35)
  Top 0.17: 92,219.01 92,217.01 92.01,217 92.01,216.6 93,215.61 J2.P$47 | 199.37,216 199.37,219 | 92,111.01 92,106.01 | 199.37,106.01 199.37,111.4 199.49,111.52